# EAGLE design BLE-LORA-Relay-30dbm-v2.1 (EAGLE 8.6.0)
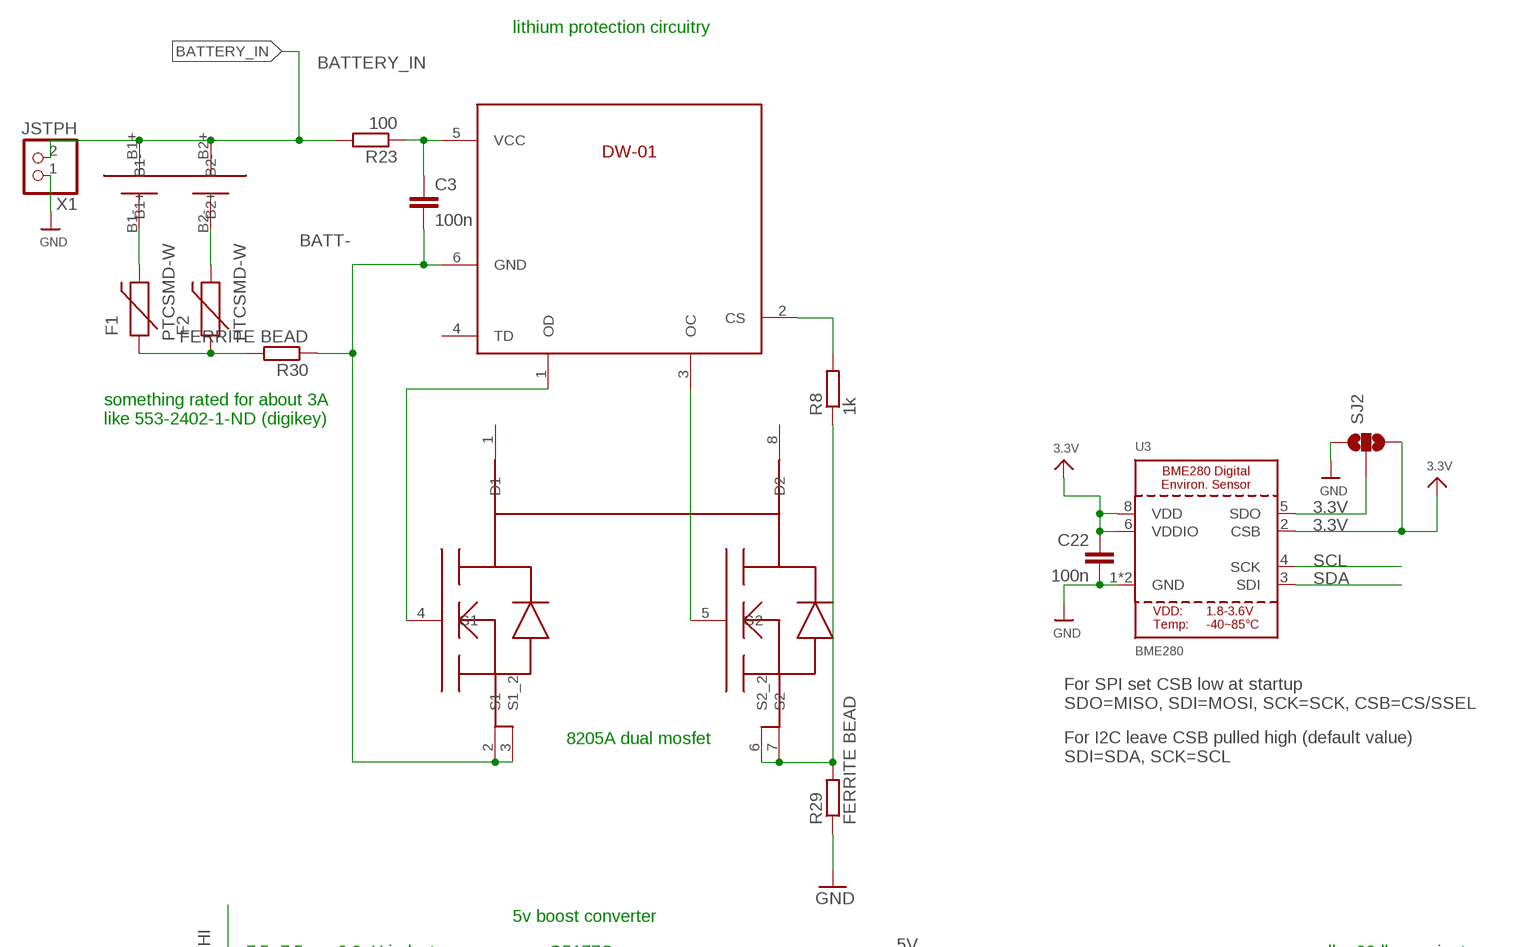
[diagram p0: schematic, sheet 1, part 1 of 3]
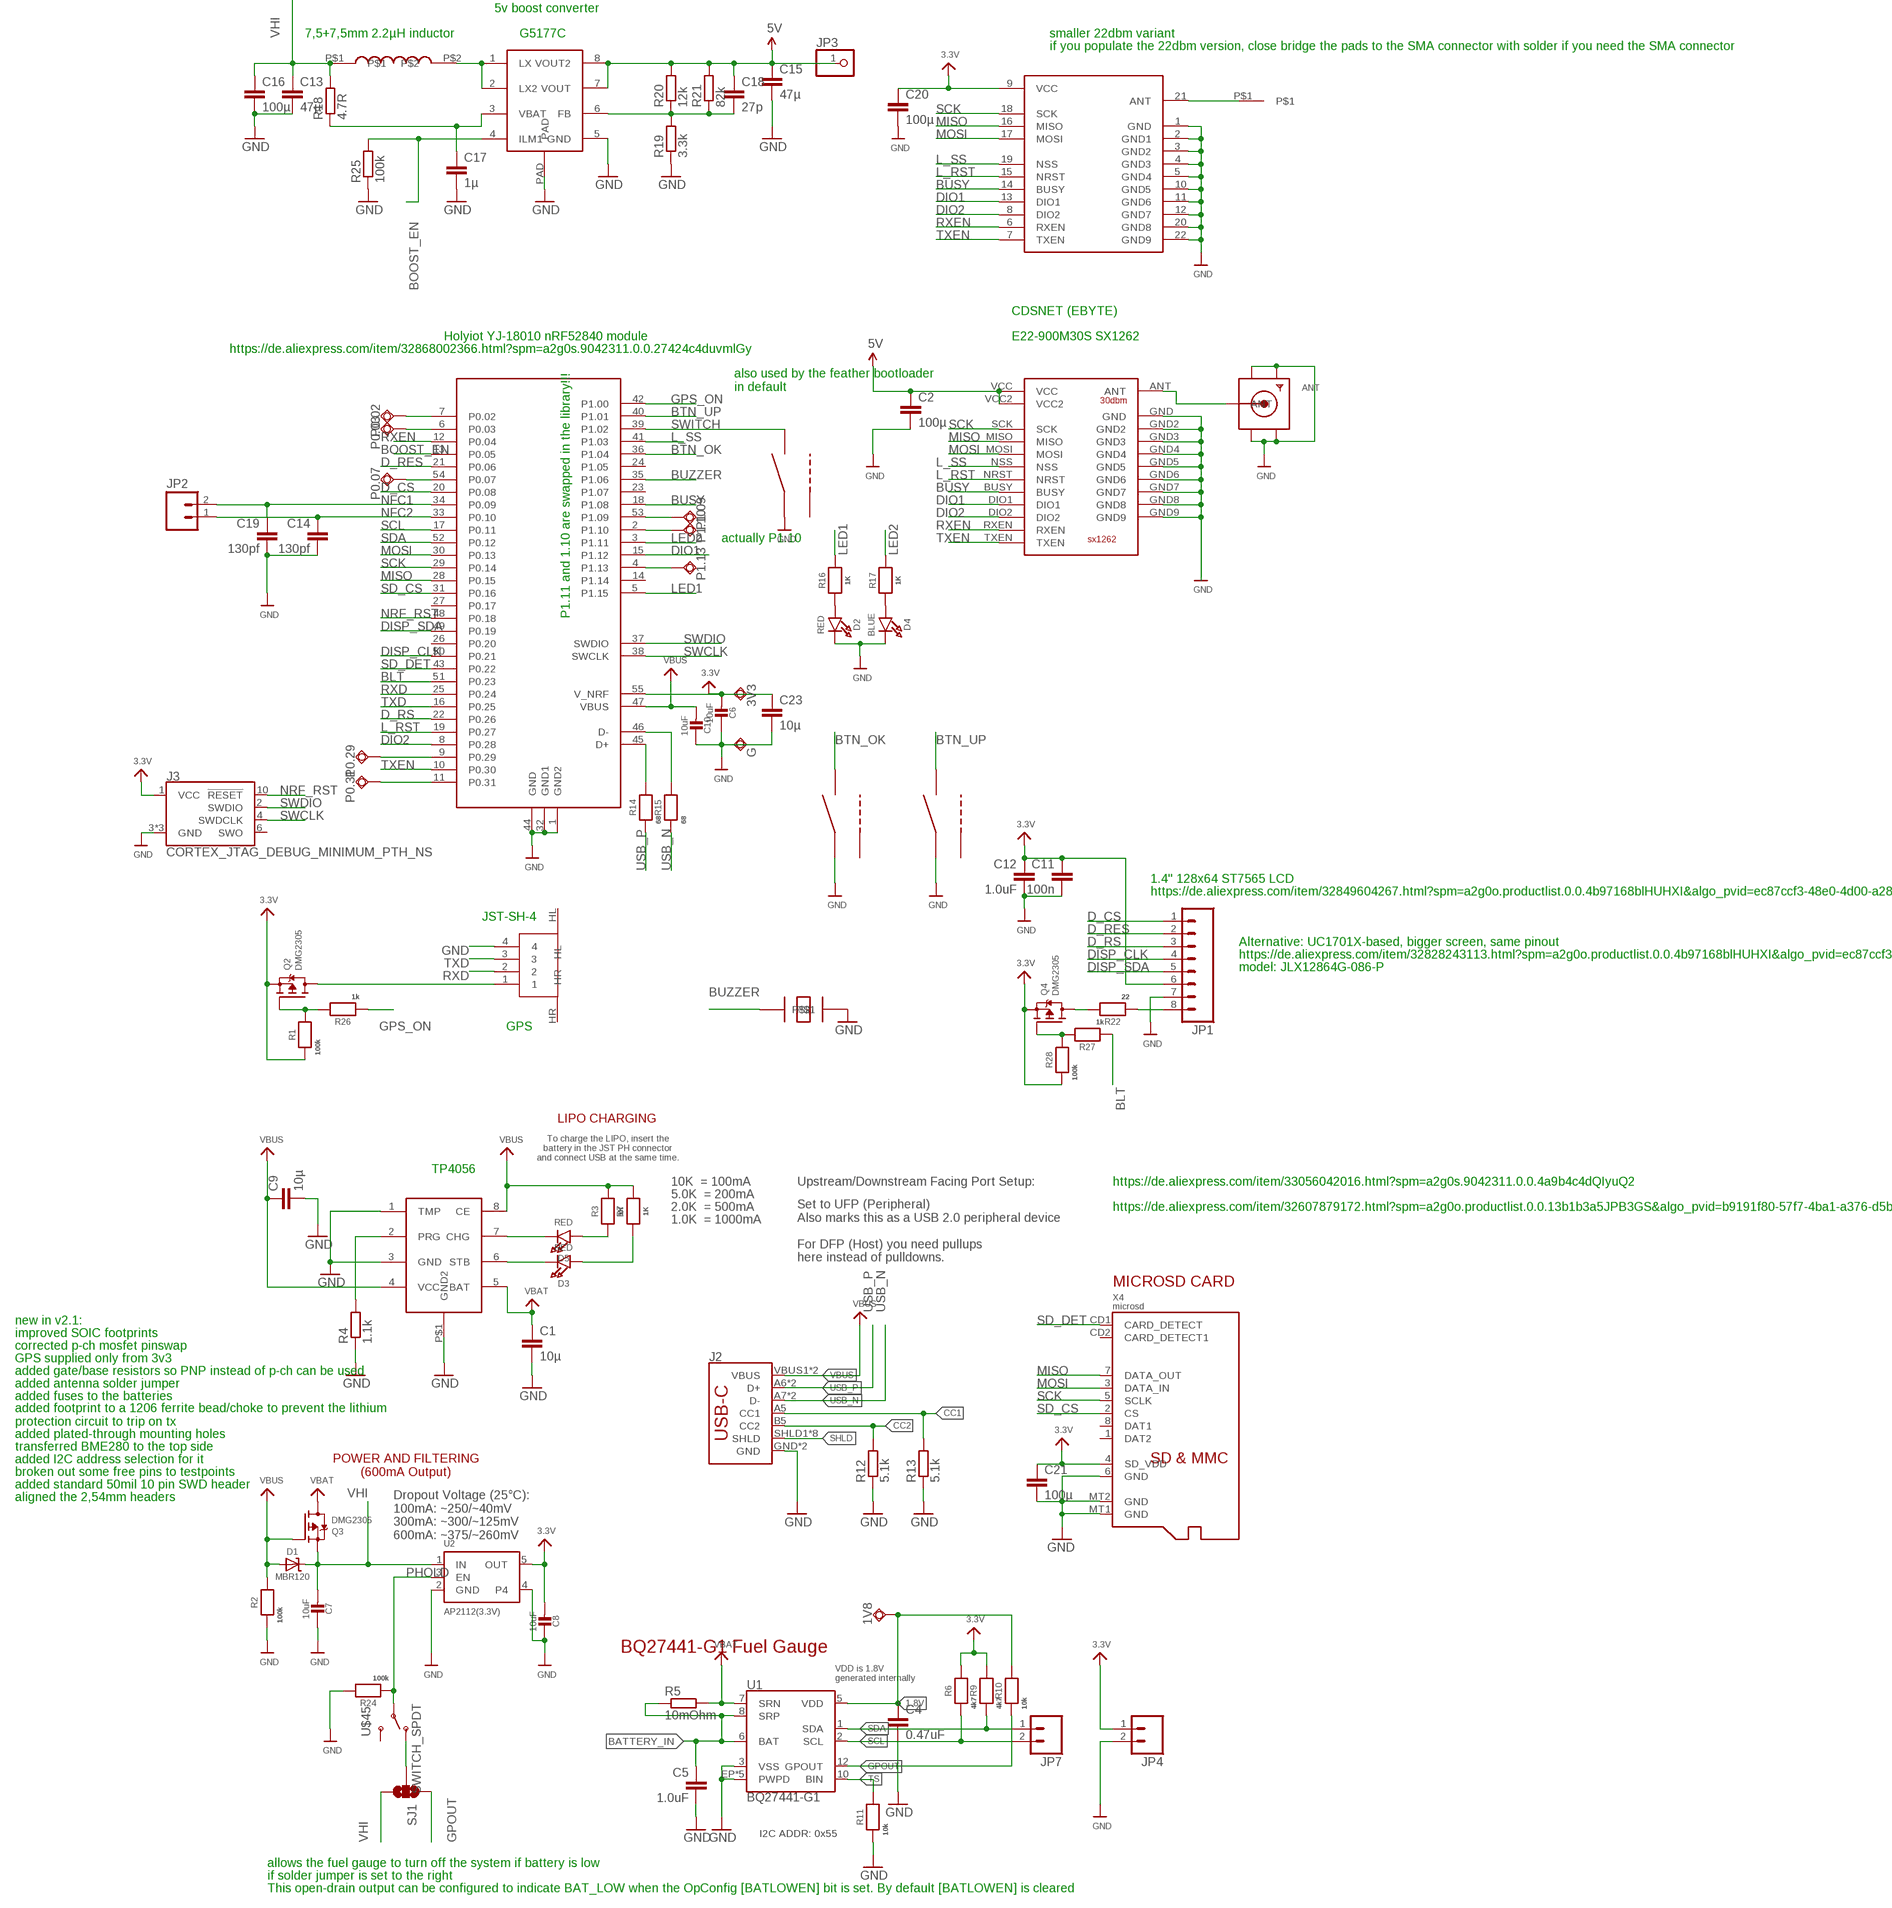
[diagram p1: schematic, sheet 1, part 2 of 3]
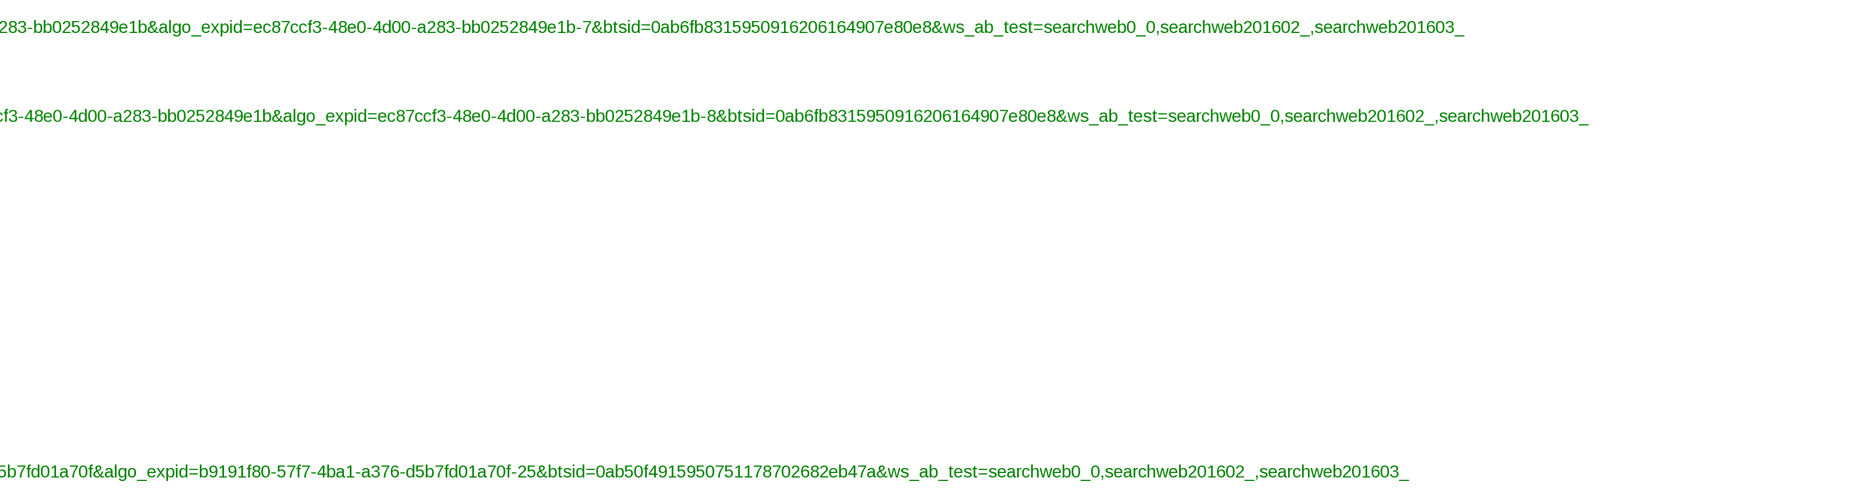
[diagram p2: schematic, sheet 1, part 3 of 3]

## Parts
1V8  TPSQTP13R  [TP13R]
3V3  TPSQTP13R  [TP13R]
ANT  SMACONNECTOR_EDGE  [SMA_EDGELAUNCH]
C1  10µ  C-EUC0805  [C0805]
C2  100µ  C-EUC1206  [C1206]
C3  100n  C-EUC0603  [C0603]
C4  0.47uF  CAP0603-CAP  [0603-CAP]
C5  1.0uF  1.0UF-16V-10%(0603)  [0603-CAP]
C6  10uF  CAP_CERAMIC0805-NOOUTLINE  [0805-NO]
C7  10uF  CAP_CERAMIC0805-NOOUTLINE  [0805-NO]
C8  10uF  CAP_CERAMIC0805-NOOUTLINE  [0805-NO]
C9  10µ  C-EUC0805  [C0805]
C10  10uF  CAP_CERAMIC0805-NOOUTLINE  [0805-NO]
C11  100n  1.0UF-16V-10%(0603)  [0603-CAP]
C12  1.0uF  1.0UF-16V-10%(0603)  [0603-CAP]
C13  47µ  C-EUC0805  [C0805]
C14  130pf  1.0UF-16V-10%(0603)  [0603-CAP]
C15  47µ  C-EUC0805  [C0805]
C16  100µ  C-EUC1206  [C1206]
C17  1µ  C-EUC0603  [C0603]
C18  27p  C-EUC0603  [C0603]
C19  130pf  1.0UF-16V-10%(0603)  [0603-CAP]
C20  100µ  C-EUC1206  [C1206]
C21  100µ  C-EUC1206  [C1206]
C22  100n  1.0UF-16V-10%(0603)  [0603-CAP]
C23  10µ  C-EUC0805  [C0805]
D1  MBR120  DIODE-SCHOTTKYSOD-123  [SOD-123]
D2  RED  LED0805_NOOUTLINE  [CHIPLED_0805_NOOUTLINE]
D3  RED  LED0805_NOOUTLINE  [CHIPLED_0805_NOOUTLINE]
D4  BLUE  LED0805_NOOUTLINE  [CHIPLED_0805_NOOUTLINE]
D5  RED  LED0805_NOOUTLINE  [CHIPLED_0805_NOOUTLINE]
DWN  LS12T2  [LS12T2]
DWN1  LS12T2  [LS12T2]
DWN2  LS12T2  [LS12T2]
F1  PTCSMD-W  [PTC-1206-WIDE]
F2  PTCSMD-W  [PTC-1206-WIDE]
G  TPSQTP13R  [TP13R]
J2  USB_C16PIN  [USB-C-16P]
J3  CORTEX_JTAG_DEBUG_MINIMUM_PTH_NS  [2X5-PTH-1.27MM-NO_SILK]
JP1  M08  [1X08_ROUND]
JP2  M02PTH  [1X02]
JP3  PINHD-1X1  [1X01]
JP4  M02PTH  [1X02]
JP7  M02PTH  [1X02]
P0.02  TPSQTP13R  [TP13R]
P0.03  TPSQTP13R  [TP13R]
P0.07  TPSQTP13R  [TP13R]
P0.29  TPSQTP13R  [TP13R]
P0.31  TPSQTP13R  [TP13R]
P1.09  TPSQTP13R  [TP13R]
P1.10  TPSQTP13R  [TP13R]
P1.13  TPSQTP13R  [TP13R]
Q2  DMG2305  MOSFET-P  [SOT23-R]
Q3  DMG2305  MOSFET-P  [SOT23-R]
Q4  DMG2305  MOSFET-P  [SOT23-R]
R1  100k  RESISTOR_0603_NOOUT  [0603-NO]
R2  100k  RESISTOR_0603_NOOUT  [0603-NO]
R3  1K  RESISTOR_0603_NOOUT  [0603-NO]
R4  1.1k  R-EU_R0603  [R0603]
R5  10mOhm  R-EU_R0805  [R0805]
R6  4k7  RESISTOR_0603_NOOUT  [0603-NO]
R7  1K  RESISTOR_0603_NOOUT  [0603-NO]
R8  1k  R-EU_R0603  [R0603]
R9  4k7  RESISTOR_0603_NOOUT  [0603-NO]
R10  10k  RESISTOR_0603_NOOUT  [0603-NO]
R11  10k  RESISTOR_0603_NOOUT  [0603-NO]
R12  5.1k  R-EU_R0603  [R0603]
R13  5.1k  R-EU_R0603  [R0603]
R14  68  RESISTOR_0603_NOOUT  [0603-NO]
R15  68  RESISTOR_0603_NOOUT  [0603-NO]
R16  1K  RESISTOR_0603_NOOUT  [0603-NO]
R17  1K  RESISTOR_0603_NOOUT  [0603-NO]
R18  4.7R  R-EU_R0603  [R0603]
R19  3.3k  R-EU_R0603  [R0603]
R20  12k  R-EU_R0603  [R0603]
R21  82k  R-EU_R0603  [R0603]
R22  22  RESISTOR_0603_NOOUT  [0603-NO]
R23  100  R-EU_R0603  [R0603]
R24  100k  RESISTOR_0603_NOOUT  [0603-NO]
R25  100k  R-EU_R0603  [R0603]
R26  1k  RESISTOR_0603_NOOUT  [0603-NO]
R27  1k  RESISTOR_0603_NOOUT  [0603-NO]
R28  100k  RESISTOR_0603_NOOUT  [0603-NO]
R29  FERRITE BEAD  R-EU_R1206  [R1206]
R30  FERRITE BEAD  R-EU_R1206  [R1206]
SJ1  SOLDERJUMPER_2WAY-OLDS  [SJ_3]
SJ2  SOLDERJUMPER_2WAY-OLDS  [SJ_3]
U1  BQ27441-G1  [PDSO-N12]
U2  AP2112(3.3V)  VREG_SOT23-5  [SOT23-5]
U3  BME280  [BME280]
U$2  BUZZER  [BUZZER]
U$10  2X18650  [2X18650]
U$14  NRF52840  [NRF52840MOD]
U$15  SX1262-30DBM  [SX1262-30DBM]
U$17  JST-SH-3  [JST-SH-3]
U$35  7.5MM-COIL  [7.5MM_COIL]
U$36  SX1292-EBYTE  [SX1262_EBYTE]
U$38  DW-01  [SOT23-6]
U$39  G5177C_G5177C  [G5177C_SO-08]
U$41  SOLDERPAD  [SOLDERPAD]
U$45  SWITCH_SPDT  [KPS-1290]
U$46  8205A  [TSSOP8]
U$47  TP4056BETTER_TP4056  [TP4056BETTER_SO-08]
X1  JSTPH  CON_JST_PH_2PIN  [JSTPH2]
X4  microsd  MICROSD  [MICROSD]

## Nets
1.8V: 1V8.TP C4.1 R10.2 U1.5(VDD)
3.3V [power]: 3V3.TP C6.2 C8.2 C11.1 C12.1 C20.1 C21.1 C22.1 C23.1 J3.1(VCC) JP1.6 JP4.1 Q2.2(S) Q4.2(S) R1.1 R6.2 R9.2 R28.1 SJ2.3 U2.5(OUT) U3.2(CSB) U3.6(VDDIO) U3.8(VDD) U$14.55(V_NRF) U$36.9(VCC) X4.4(SD_VDD)
5V: C2.1 C15.1 C18.1 JP3.1 R20.2 R21.2 U$15.VCC U$15.VCC2 U$39.7(VOUT) U$39.8(VOUT2)
ANT: ANT.P(ANT) U$15.ANT
BATT-: C3.2 R30.1 U$38.6(GND) U$46.2(S1) U$46.3(S1_2)
BATTERY_IN: C5.1 R5.1 R23.2 U1.6(BAT) U1.8(SRP) U$10.B1+ U$10.B2+ X1.2
BLT: R27.1 U$14.51(P0.23)
BOOST_EN: R25.2 U$14.13(P0.05) U$39.4(ILM1)
BTN_OK [power]: DWN.1 U$14.36(P1.04)
BTN_UP: DWN1.1 U$14.40(P1.01)
BUSY: U$14.18(P1.08) U$15.BUSY U$36.14(BUSY)
BUZZER: U$2.P$1 U$14.35(P1.06)
CC1: J2.A5(CC1) R13.2
CC2: J2.B5(CC2) R12.2
D_CS: JP1.1 U$14.20(P0.08)
D_RES: JP1.2 U$14.21(P0.06)
D_RS: JP1.3 U$14.22(P0.26)
DIO1: U$14.15(P1.12) U$15.DIO1 U$36.13(DIO1)
DIO2: U$14.8(P0.28) U$15.DIO2 U$36.8(DIO2)
DISP_CLK: JP1.4 U$14.50(P0.21)
DISP_SDA: JP1.5 U$14.49(P0.19)
FB: C18.2 R19.2 R20.1 R21.1 U$39.6(FB)
GGGG: Q4.1(G) R27.2 R28.2
GND: ANT.GND@1(GND4) ANT.GND@2(GND3) ANT.GND@3(GND2) ANT.GND@4(GND1) C1.2 C2.2 C4.2 C5.2 C6.1 C7.1 C8.1 C9.2 C10.1 C11.2 C12.2 C13.2 C14.2 C15.2 C16.2 C17.2 C19.2 C20.2 C21.2 C22.2 C23.2 D2.C D4.C DWN1.2 DWN2.2 DWN.2 G.TP J2.GND J2.GND2(GND) J3.3(GND) J3.5(GND) J3.9(GND) JP1.7 JP4.2 R2.1 R4.1 R11.1 R12.1 R13.1 R19.1 R24.2 R25.1 R29.1 SJ2.1 U1.3(VSS) U1.EP1(PWPD) U1.EP2(PWPD) U1.EP3(PWPD) U1.EP4(PWPD) U1.EP(PWPD) U2.2(GND) U2.4 U3.1(GND) U3.7(GND) U$2.P$2 U$14.1(GND2) U$14.32(GND1) U$14.44(GND) U$15.GND U$15.GND2 U$15.GND3 U$15.GND4 U$15.GND5 U$15.GND6 U$15.GND7 U$15.GND8 U$15.GND9 U$17.4 U$36.1(GND) U$36.2(GND1) U$36.3(GND2) U$36.4(GND3) U$36.5(GND4) U$36.10(GND5) U$36.11(GND6) U$36.12(GND7) U$36.20(GND8) U$36.22(GND9) U$39.5(GND) U$39.PAD U$47.1(TMP) U$47.3(GND) U$47.P$1(GND2) X1.1 X4.6(GND) X4.MT1(GND) X4.MT2(GND)
GPOUT: R10.1 SJ1.1 U1.12(GPOUT)
GPS_ON: R26.1 U$14.42(P1.00)
L_RST: U$14.19(P0.27) U$15.NRST U$36.15(NRST)
L_SS: U$14.41(P1.03) U$15.NSS U$36.19(NSS)
LED1: R16.2 U$14.5(P1.15)
LED2: R17.2 U$14.3(P1.11)
MISO: U$14.28(P0.15) U$15.MISO U$36.16(MISO) X4.7(DATA_OUT)
MOSI: U$14.30(P0.13) U$15.MOSI U$36.17(MOSI) X4.3(DATA_IN)
N$1: D5.A R3.1
N$2: Q4.3(D) R22.2
N$3: SJ1.2 U$45.O
N$4: JP1.8 R22.1
N$5: Q2.1(G) R1.2 R26.2
N$6: R14.2 U$14.45(D+)
N$7: R15.2 U$14.46(D-)
N$8: D3.A R7.1
N$9: U$38.1(OD) U$46.4(G1)
N$10: R4.2 U$47.2(PRG)
N$11: D3.C U$47.6(STB)
N$12: D5.C U$47.7(CHG)
N$13: D2.A R16.1
N$14: D4.A R17.1
N$15: Q2.3(D) U$17.1
N$16: C17.1 R18.1 U$39.3(VBAT)
N$17: U$35.P$2 U$39.1(LX) U$39.2(LX2)
N$18: U$38.3(OC) U$46.5(G2)
N$19: C3.1 R23.1 U$38.5(VCC)
N$20: U$36.21(ANT) U$41.P$1
N$21: F1.2 U$10.B1-
N$22: F2.2 U$10.B2-
N$23: R8.2 U$38.2(CS)
N$24: R8.1 R29.2 U$46.6(S2_2) U$46.7(S2)
N$25: SJ2.2 U3.5(SDO)
N$26: P0.02.TP U$14.7(P0.02)
N$27: P0.03.TP U$14.6(P0.03)
N$28: P1.10.TP U$14.2(P1.10)
N$29: P1.13.TP U$14.4(P1.13)
N$30: P0.31.TP U$14.11(P0.31)
N$31: P0.29.TP U$14.9(P0.29)
N$32: P1.09.TP U$14.53(P1.09)
N$33: P0.07.TP U$14.54(P0.07)
N$34: F1.1 F2.1 R30.2
NFC1: C19.1 JP2.2 U$14.34(P0.09)
NFC2: C14.1 JP2.1 U$14.33(P0.10)
NRF_RST: J3.10(!RESET) U$14.48(P0.18)
PHOLD: R24.1 U2.3(EN) U$45.P
RXD: U$14.25(P0.24) U$17.2
RXEN: U$14.12(P0.04) U$15.RXEN U$36.6(RXEN)
SCK: U$14.29(P0.14) U$15.SCK U$36.18(SCK) X4.5(SCLK)
SCL: JP7.2 R6.1 U1.2(SCL) U3.4(SCK) U$14.17(P0.11)
SD_CS: U$14.31(P0.16) X4.2(CS)
SD_DET: U$14.43(P0.22) X4.CD1(CARD_DETECT)
SDA: JP7.1 R9.1 U1.1(SDA) U3.3(SDI) U$14.52(P0.12)
SHLD: J2.SHLD1(SHLD) J2.SHLD2(SHLD) J2.SHLD3(SHLD) J2.SHLD4(SHLD) J2.SHLD5(SHLD) J2.SHLD6(SHLD) J2.SHLD7(SHLD) J2.SHLD8(SHLD)
SWCLK: J3.4(SWDCLK) U$14.38(SWCLK)
SWDIO: J3.2(SWDIO) U$14.37(SWDIO)
SWITCH: DWN2.1 U$14.39(P1.02)
TS: R11.2 U1.10(BIN)
TXD: U$14.16(P0.25) U$17.3
TXEN: U$14.10(P0.30) U$15.TXEN U$36.7(TXEN)
USB_N: J2.A7(D-) J2.B7(D-) R15.1
USB_P: J2.A6(D+) J2.B6(D+) R14.1
VBAT [power]: C1.1 Q3.3(D) R5.2 U1.7(SRN) U$47.5(BAT)
VBUS [power]: C9.1 C10.2 D1.A J2.VBUS1(VBUS) J2.VBUS2(VBUS) Q3.1(G) R2.2 R3.2 R7.2 U$14.47(VBUS) U$47.4(VCC) U$47.8(CE)
VHI [power]: C7.2 C13.1 C16.1 D1.C Q3.2(S) R18.2 SJ1.3 U2.1(IN) U$35.P$1
Unconnected: DWN1.FRAME(FRM) DWN2.FRAME(FRM) DWN.FRAME(FRM) J3.6(SWO) U$14.14(P1.14) U$14.23(P1.07) U$14.24(P1.05) U$14.26(P0.20) U$14.27(P0.17) U$17.HL U$17.HR U$38.4(TD) U$45.S U$46.1(D1) U$46.8(D2) X4.1(DAT2) X4.8(DAT1) X4.CD2(CARD_DETECT1)

## Notes on the sheet
- lithium protection circuitry
- something rated for about 3A
  like 553-2402-1-ND (digikey)
- For SPI set CSB low at startup
  SDO=MISO, SDI=MOSI, SCK=SCK, CSB=CS/SSEL
- 8205A dual mosfet
- For I2C leave CSB pulled high (default value)
  SDI=SDA, SCK=SCL
- 5v boost converter
- 7,5+7,5mm 2.2µH inductor | G5177C | smaller 22dbm variant
- if you populate the 22dbm version, close bridge the pads to the SMA connector with solder if you need the SMA connector
- CDSNET (EBYTE)
- Holyiot YJ-18010 nRF52840 module | E22-900M30S SX1262
- https://de.aliexpress.com/item/32868002366.html?spm=a2g0s.9042311.0.0.27424c4duvmlGy
- also used by the feather bootloader 
  in default
- actually P1.10
- P1.11 and 1.10 are swapped in the library!!!
- 1.4'' 128x64 ST7565 LCD
- https://de.aliexpress.com/item/32849604267.html?spm=a2g0o.productlist.0.0.4b97168blHUHXI&algo_pvid=ec87ccf3-48e0-4d00-a283-bb0252849e1b&algo_expid=ec87ccf3-48e0-4d00-a283-bb0252849e1b-7&btsid=0ab6fb8315950916206164907e80e8&ws_ab_test=searchweb0_0,searchweb201602_,searchweb201603_
- JST-SH-4
- Alternative: UC1701X-based, bigger screen, same pinout
- https://de.aliexpress.com/item/32828243113.html?spm=a2g0o.productlist.0.0.4b97168blHUHXI&algo_pvid=ec87ccf3-48e0-4d00-a283-bb0252849e1b&algo_expid=ec87ccf3-48e0-4d00-a283-bb0252849e1b-8&btsid=0ab6fb8315950916206164907e80e8&ws_ab_test=searchweb0_0,searchweb201602_,searchweb201603_
- model: JLX12864G-086-P
- GPS
- LIPO CHARGING
- To charge the LIPO, insert the
  battery in the JST PH connector
  and connect USB at the same time.
- TP4056
- 10K  = 100mA | Upstream/Downstream Facing Port Setup: | https://de.aliexpress.com/item/33056042016.html?spm=a2g0s.9042311.0.0.4a9b4c4dQIyuQ2
- 5.0K  = 200mA
- 2.0K  = 500mA | https://de.aliexpress.com/item/32607879172.html?spm=a2g0o.productlist.0.0.13b1b3a5JPB3GS&algo_pvid=b9191f80-57f7-4ba1-a376-d5b7fd01a70f&algo_expid=b9191f80-57f7-4ba1-a376-d5b7fd01a70f-25&btsid=0ab50f4915950751178702682eb47a&ws_ab_test=searchweb0_0,searchweb201602_,searchweb201603_
- 1.0K  = 1000mA
- Set to UFP (Peripheral)
  Also marks this as a USB 2.0 peripheral device
  
  For DFP (Host) you need pullups
  here instead of pulldowns.
- MICROSD CARD
- new in v2.1:
- improved SOIC footprints
- corrected p-ch mosfet pinswap
- GPS supplied only from 3v3
- added gate/base resistors so PNP instead of p-ch can be used
- added antenna solder jumper
- added fuses to the batteries
- added footprint to a 1206 ferrite bead/choke to prevent the lithium  
  protection circuit to trip on tx
- added plated-through mounting holes
- transferred BME280 to the top side
- added I2C address selection for it
- broken out some free pins to testpoints
- POWER AND FILTERING
  (600mA Output)
- added standard 50mil 10 pin SWD header
- aligned the 2,54mm headers
- Dropout Voltage (25°C):
  100mA: ~250/~40mV
  300mA: ~300/~125mV
  600mA: ~375/~260mV
- BQ27441-G1 Fuel Gauge
- VDD is 1.8V
  generated internally
- I2C ADDR: 0x55
- allows the fuel gauge to turn off the system if battery is low
- if solder jumper is set to the right
- This open-drain output can be configured to indicate BAT_LOW when the OpConfig [BATLOWEN] bit is set. By default [BATLOWEN] is cleared

## Library data of the parts
1V8 3V3 G P0.02 P0.03 P0.07 P0.29 P0.31 P1.09 P1.10 P1.13 = testpad:TPSQ: Test pad
ANT = adafruit:SMACONNECTOR: SMA Connector 90° DIP SMA Connector, 50 Ohm (4UConnector: 07259)
C1-C3 C9 C13 C15-C18 C20 C21 C23 = rcl:C-EU: CAPACITOR, European symbol; SPICEPREFIX: C
C4 = SparkFun-Capacitors:CAP: Capacitor Standard 0603 ceramic capacitor, and 0.1" leaded capacitor.; PROD_ID: CAP-13216
C5 C12 = SparkFun-Capacitors:1.0UF-16V-10%(0603): CAP-00868; PROD_ID: CAP-00868
C6-C8 C10 = microbuilder:CAP_CERAMIC: Ceramic Capacitors For new designs, use the packages preceded by an '_' character since they are more reliable: The following footprints should be used on most boards: _0402 - Standard footprint for regular board layouts _0603 - Standard footprint for regular board layouts _0805 - Standard footprint for regular board layouts _1206 - Standard footprint for regular board layouts For extremely tight-pitch boards where space is at a premium, the following 'micro-pitch' footprints can be used (smaller pads, no silkscreen outline, etc.): _0402MP - Micro-pitch footprint for very dense/compact boards _0603MP - Micro-pitch footprint for very dense/compact boards _0805MP - Micro-pitch footprint for very dense/compact boards _1206MP - Micro-pitch footprint for very dense/compact boards
C11 C14 C19 C22 = SparkFun-Capacitors:1.0UF-16V-10%(0603): CAP-00868; PROD_ID: CAP-00868; VALUE: 1.0uF
D1 = microbuilder:DIODE-SCHOTTKY
D2-D5 = microbuilder:LED: LED 0603 - 0603 Surface Mount Package 2mA: Green LED - Low Power (3.9mcd, 2ma, 1.7Vf) - Digikey: 475-2709-2-ND Orange LED - Low Power (9.8mcd, 2ma, 1.8Vf) - Digikey: 475-1194-2-ND Red LED - Low Power (5mcd, 2ma, 1.8Vf) - Digikey: 475-1195-2-ND Yellow LED - Low Power (7mcd, 2ma, 1.8Vf) - Digikey: 475-1196-2-ND 5mA: Blue LED - Low Power (17mcd, 5ma, 2.9Vf) - Digikey: LNJ937W8CRACT-ND 0805 - 0805 Surface Mount Package 2mA: Red LED (8.8mcd, 2mA, 1.8Vf, Clear) - Low Power [Digikey: 475-2510-1-ND] Green LED (5mcd, 2mA, 1.8Vf, Clear) - Low Power [Digikey: 475-2730-1-ND] Yellow LED (11.3mcd, 2mA, 1.8Vf, Clear) - Low Power [Digikey: 475-2555-1-ND] 20mA: Red LED (104mcd, 20mA, Diffused) - LS R976 [Digikey: 475-1278-6-ND] Red LED (12mcd, 20mA, 2.0Vf, Clear) - APT2012EC [Digikey: 754-1128-1-ND] Green LED (15mcd, 20mA, 2.2Vf, Clear) - APT2012GC [Digikey: 754-1131-1-ND] Orange LED (160mcd, 20mA, 2.1Vf, Clear) - APT2012SECK [Digikey: 754-1130-1-ND] 1206 - 1206 Surface Mount Package Green LED (26mcd, 20mA, Diffused) - LG N971 [Digikey: 475-1407-6-ND] Red LED (15mcd, 20mA, Diffused) - LH N974 [Digikey: 475-1416-6-ND] Cree - Cree High-Power Surface Mount LEDs XPEBWT-L1-0000-00D50 - White 111lm 350mA 2.9Vf 6200K 110° XTEAWT-00-0000-00000LEE3 - White 114lm 350mA 2.85Vf 5000K 115° Everlight - Everlight 45-21 Series Surface Mount LEDs 45-21/QK2C-B2832AC2CB2/2T - Warm White 2000mcd 20mA 3.25Vf 3050K 120° 45-21/LK2C-B38452C4CB2/2T - Nuetral White 2000mcd 20mA 3.25Vf 4150K 120° 45-21/LK2C-B50634C6CB2/2T - Cold White 2200mcd 20mA 3.25Vf 5650K 120° PLCC2 Reverse Mount LS T77K-J1L2-1-0-2-R18-Z - Red 11.25mcd 2mA 1.8Vf 630nm 120° LO T77K-L1M2-24-Z - Orange 19.6mcd 2mA 1.8Vf 606nm 120° LY T77K-K2M1-26-Z - Yellow 15.7mcd 2mA 1.8Vf 587nm 120°
DWN DWN1 DWN2 = LS12T2:LS12T2
F1 F2 = SparkFun-PowerIC:PTC: Resettable Fuse PTC Resettable Fuse. Spark Fun Electronics SKU : COM-08357
J2 = SparkFun-Connectors:USB_C: USB Type C 16Pin Connector Super Speed pins not available on the 16-pin purely SMD connector so this part is best for USB 2.0 implementations. D1 and D2 are tied together enabling D+/- no matter which way the cable is plugged into the connector. The two channel configuration pins (CC1/2) are exposed. These are normally connected to ground via 5.1k resistors but can be reconfigured for high current/high power applications.; PROD_ID: CONN-14122
J3 = SparkFun-Connectors:CORTEX_JTAG_DEBUG_MINIMUM: Cortex Debug Connector - 10 pin Supports JTAG debug, Serial Wire debug, and Serial Wire Viewer. PTH and SMD connector options available. General Connector Information <http://infocenter.arm.com/help/topic/com.arm.doc.faqs/attached/13634/cortex_debug_connectors.pdf> Products: PTH Connector <http://www.digikey.com/product-detail/en/cnc-tech/3220-10-0100-00/1175-1627-ND/3883661> -via Digi-Key SparkFun PSoc <https://www.sparkfun.com/products/13229> SparkFun T <https://www.sparkfun.com/products/13810>
JP1 = SparkFun-Connectors:M08: Header 8 Standard 8-pin 0.1" header. Use with straight break away headers (SKU : PRT-00116), right angle break away headers (PRT-00553), swiss pins (PRT-00743), machine pins (PRT-00117), and female headers (PRT-00115).
JP2 JP4 JP7 = SparkFun-Connectors:M02: Standard 2-pin 0.1" header. Use with - straight break away headers ( PRT-00116) - right angle break away headers (PRT-00553) - swiss pins (PRT-00743) - machine pins (PRT-00117) - female headers (PRT-00115) Molex polarized connector foot print use with: PRT-08233 with associated crimp pins and housings. 2.54_SCREWTERM for use with PRT-10571. 3.5mm Screw Terminal footprints for PRT-08084 5mm Screw Terminal footprints for use with PRT-08432
JP3 = adafruit:PINHD-1X1: Pin header 1x1 for 0.1" spacing With round pins
Q2-Q4 = microbuilder:MOSFET-P: P-Channel Mosfet LEGEND VDS: Voltage Drain-Source ID: Drain Current RDS(ON): Drain-Source On-State Resistance VGS(TH): Gate-Source Threshold Voltage CISS: Drain-Source Input Capacitance SOT-23 Name VDS ID RDS(ON) VGS(TH) CISS Order Number IRLML5103 30V 760mA 600 mOhm -- 75pF @ 25V Digikey: IRLML5103PBFCT-ND IRLML6401 12V 4.3A 50 mOhm 950mV @ 250µA 830pF @ 10V Digikey: IRLML6401PBFTR-ND NTR0202PL 20V 400mA 800 mOhm 2.3V @ 250uA 70pF @ 5V Digikey: NTR0202PLT1GOSTR-ND NTR4101PT1G 20V 1.8A 85 mOhm 1.2V @ 250uA 675pF @ 10V Digikey: NTR4101PT1GOSCT-ND DMP2004K 20V 600mA 900 mOhm 1V @ 250uA 175pF @ 16V Digikey: DMP2004KDICT-ND PMV65XP 20V 3.9A 76 mOhm 950mV @ 1mA 725pF @ 20V Digikey: 568-2358-2-ND TO-252 Name VDS ID RDS(ON) VGS(TH) CISS Order Number AOD417 30V 25A 34 mOhm 3V @ 250µA 920pF @ 15V Digikey: 785-1106-2-ND PowerPak Name VDS ID RDS(ON) VGS(TH) CISS Order Number AON7401 30V 12A 14 mOhm 3V @ 250µA 2600pF @ 15V Digikey: 785-1302-1-ND
R1-R3 R6 R7 R9-R11 R14-R17 R22 R24 R26-R28 = microbuilder:RESISTOR: Resistors For new designs, use the packages preceded by an '_' character since they are more reliable: The following footprints should be used on most boards: _0402 - Standard footprint for regular board layouts _0603 - Standard footprint for regular board layouts _0805 - Standard footprint for regular board layouts _1206 - Standard footprint for regular board layouts For extremely tight-pitch boards where space is at a premium, the following 'micro-pitch' footprints can be used (smaller pads, no silkscreen outline, etc.): _0402MP - Micro-pitch footprint for very dense/compact boards _0603MP - Micro-pitch footprint for very dense/compact boards _0805MP - Micro-pitch footprint for very dense/compact boards _1206MP - Micro-pitch footprint for very dense/compact boards
R4 R5 R8 R12 R13 R18-R21 R23 R25 = rcl:R-EU_: RESISTOR, European symbol; SPICEPREFIX: R
R29 R30 = rcl:R-EU_: RESISTOR, European symbol
SJ1 SJ2 = SparkFun-Retired:SOLDERJUMPER_2WAY-OLD: Solder Jumper 2 way solder jumper
U1 = battery-management-temp:BQ27441-G1; PROD_ID: IC-13220
U2 = microbuilder:VREG_SOT23-5: SOT23-5 Fixed Voltage Regulators Part Current Out V Out V In V Dropout θJA (°C/W) TJ (°C) Digikey Part No. ADP121 150mA 3.3V 3.4-5.5V 0.09V @ 150mA -- -- ADP121-AUJZ33R7CT-ND ADP121 150mA 3.0V 3.1-5.5V 0.09V @ 150mA -- -- ADP121-AUJZ30R7CT-ND ADP122 300mA 3.3V 3.4-5.5V 0.085V @ 300mA -- -- ADP122AUJZ-3.3-R7CT-ND ADP1712 300mA 3.3V 3.5-5.5V 0.17V @ 300mA -- -- ADP1712AUJZ-3.3-R7TR-ND AP7311 (Low Cost) 150mA 3.3V 3.5-6V 0.15V @ 150mA -- -- AP7311-33WG-7DICT-ND LD39015M18R 150mA 1.8V 1.9V-5.5V 0.08V @ 100mA -- -- 497-6977-1-ND LP2985A-33DBVR 150mA 3.3V 3.3-16V 0.28V @ 150mA 206 150 296-18479-1-ND MCP1824T-3302E/OT 300mA 3.3V 3.5V-6V 0.2V @ 300mA -- -- MCP1824T-3302E/OTCT-ND MIC5205-2.5YM5 TR 150mA 2.5V 2.7-16V 0.165V @ 150mA -- -- 576-1257-2-ND MIC5205-3.0YM5 TR 150mA 3.0V 3.2V-16V 0.165V @ 150mA -- -- 576-1258-2-ND MIC5205-3.3YM5 TR 150mA 3.3V 3.5V-16V 0.165V @ 150mA -- -- 576-1259-2-ND TPS780330220 150mA 3.3V+2.2V 3.6-5.5V 250mV Max -- -- 296-23332-1-ND TDA3663/N1,135 100mA 3.3V 3.5-45V 0.18V @ 50mA -- -- 568-5343-1-ND Max operating temp can be calculated using θJA, TJ (max junction temperature), and power in watts. Set the "Maximum Ambient Temperature" until it reaches TJ ("Max Junction Temperature"), which is the absolute limit for safe use of the regulator: Heat Sink Temperature Calculator <http://www.daycounter.com/Calculators/Heat-Sink-Temperature-Calculator.phtml> For example, With 12V source into a 3.3V LP2985 and a 30mA load, we are dissipating (12V-3.3V) * 0.03A = 0.261W. With a θJA of 206 °C/W, a TJ of 150°C, and 261mW we can safely use the chip without a heat sink up to 75°C (=147.1°C Junction Temperature).
U3 = microbuilder:BME280: BME280 - Environmental Sensor (I2C + SPI)
U$2 = buzzer:BUZZER
U$10 = 2x18650:2X18650
U$14 = nrf52840mod:NRF52840
U$15 = SX1262-30dbm:SX1262-30DBM
U$17 = JST-SH-4:JST-SH-3
U$35 = 7.5mm-COIL:7.5MM-COIL
U$36 = sx1262-EBYTE:SX1292-EBYTE
U$38 = DW-01:DW-01
U$39 = TP4056andGC5177:G5177C_G5177C
U$41 = solderpad:SOLDERPAD
U$45 = SparkFun-Retired:SWITCH_SPDT: SWCH-10651 Side-actuated SPDT slide switch, as used on the Arduino Pro; PROD_ID: SWCH-10651
U$46 = 8205A:8205A
U$47 = TP4056andGC5177:TP4056BETTER_TP4056
X1 = microbuilder:CON_JST_PH_2PIN: JST 2-Pin Right-Angle Connector PH-Series - 4UConnector: 17311 SH-Series - 4UConnector: 07278
X4 = microbuilder:MICROSD: MicroSD/Transflash Card Holder with SPI pinout 3M: 2908-05WB-MG 4UConnector: 19656 Footprint courtesy: Adafruit Industries

## Net classes
1 power: width 0.178 mm

## Board
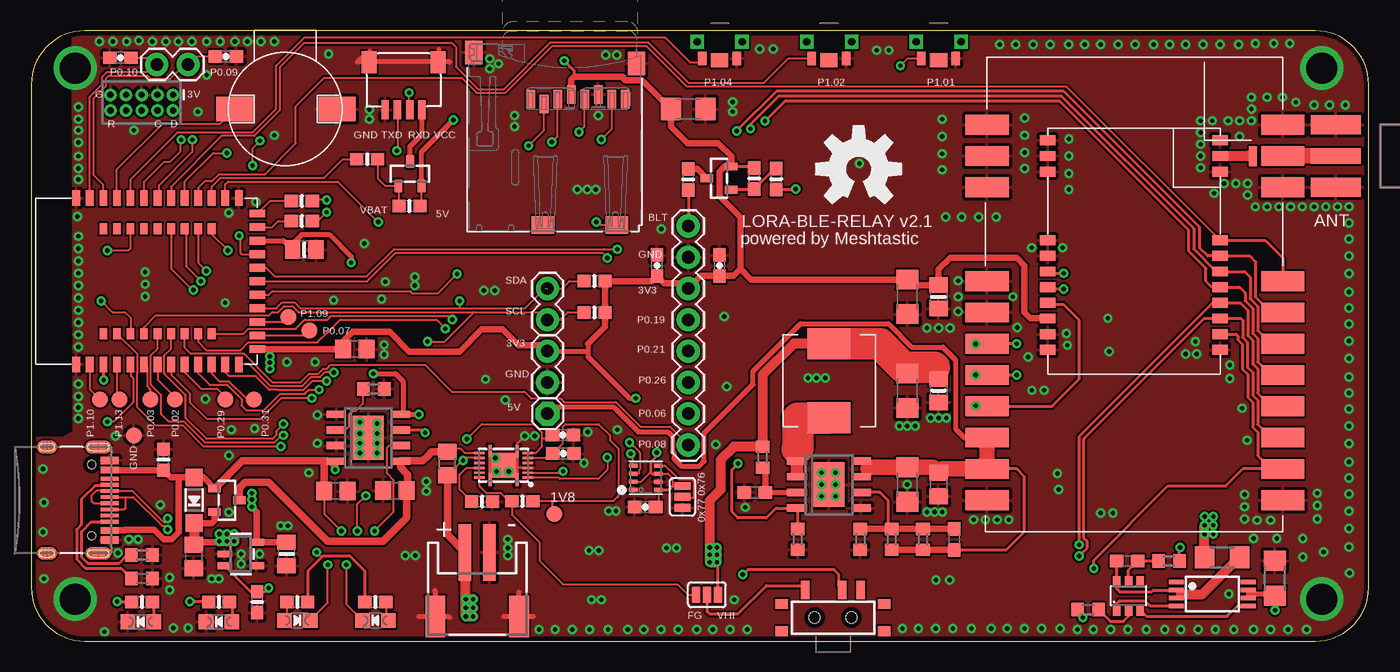
[diagram p3: board, top side]
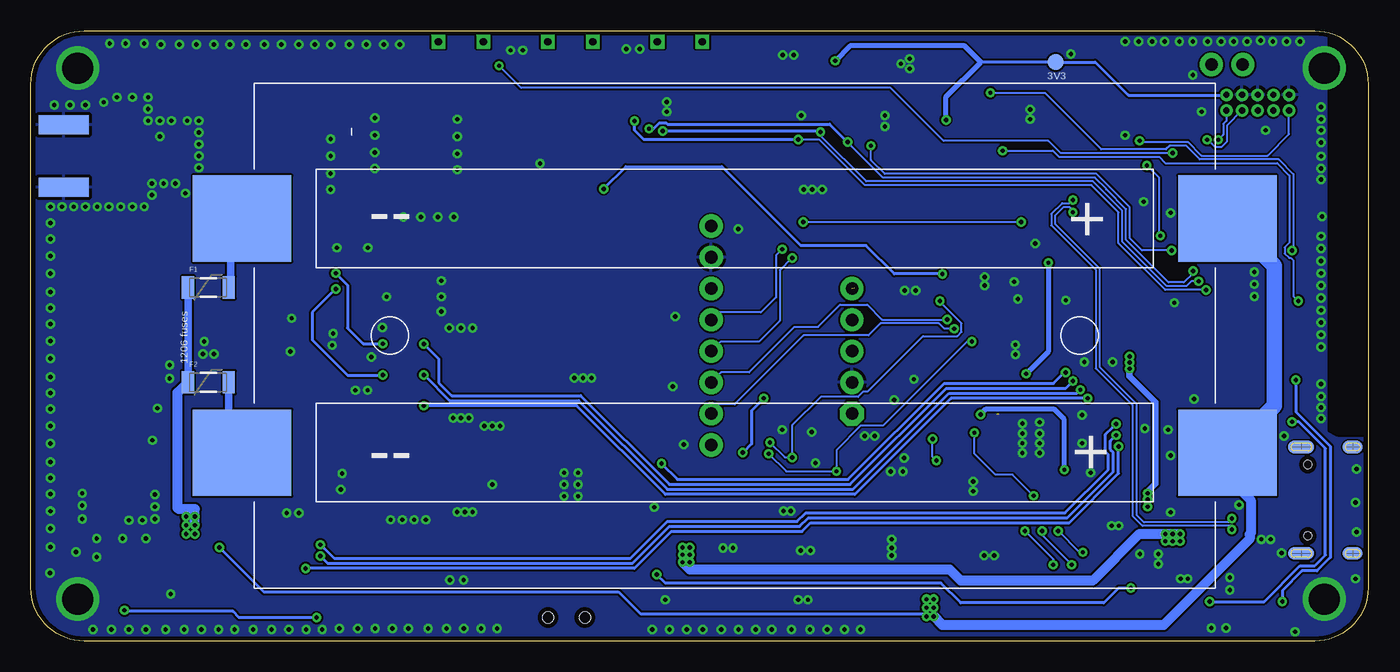
[diagram p4: board, bottom side, seen from below]

Size 108.58 x 49.53 mm. Coordinates in mm from the lower left corner, seen from the top.
Outline: 108.58,4.34 108.58,45.19 arc90 104.25,49.53 4.34,49.53 arc90 0,45.19 0,4.34 arc90 4.34,0 104.25,0 arc90 108.58,4.34
Copper layers (1*16): Top 0.035mm / dielectric 1.5mm / Bottom 0.035mm
Design rules "default *": minimum track width 6mil, minimum drill 0.35mm, track to track 6mil, track to pad 6mil, pad to pad 6mil, via to via 6mil, smd to smd 6mil, copper to edge 15mil, drill to drill 6mil, minimum pad ring 10mil, minimum via ring 8mil, stop-mask expansion 4mil, vias tented up to drill 20mil, thermal gap 10mil

### Footprints (pad centres in the part's own frame; a part is rotated, then mirrored left to right if it is on the bottom)
TP13R = smd 1.3 x 1.3: TP 0,0
SMA_EDGELAUNCH = smd 4.064 x 1.524: GND@1 2.032,-2.54; GND@2 2.032,2.54 | smd 4.064 x 1.524 bottom: GND@3 2.032,2.54; GND@4 2.032,-2.54 | smd 4.064 x 1.27: P 2.032,0
C0805 = smd 1.3 x 1.5: 1 -0.95,0; 2 0.95,0
C1206 = smd 1.6 x 1.8: 1 -1.4,0; 2 1.4,0
C0603 = smd 1.1 x 1: 1 -0.85,0; 2 0.85,0
0603-CAP = smd 1.1 x 1: 1 -0.85,0; 2 0.85,0
0805-NO = smd 1.24 x 1.5: 1 -0.95,0; 2 0.95,0
SOD-123 = smd 1.4 x 1.4: A 1.85,0; C -1.85,0
CHIPLED_0805_NOOUTLINE = smd 1.2 x 1.2: A 0,-1.05; C 0,1.05
LS12T2 = smd 1.1 x 0.7: 1 0,1.4; 2 0,-1.4 | smd 1.1 x 1.4: FRAME -0.15,0 | drill 0.6 pad 1.016 square: P$4 1.35,-1.825; P$5 1.35,1.825
PTC-1206-WIDE = smd 1 x 1.8: 1 -1.654,0; 2 1.654,0
USB-C-16P = smd 0.3 x 1.45: A5 -1.25,0; A6 -0.25,0; A7 0.25,0; A8 1.25,0; B5 1.75,0; B6 0.75,0; B7 -0.75,0; B8 -1.75,0 | smd 0.6 x 1.45: GND -3.225,0; GND2 3.225,0 | smd 1 x 2.1: SHLD1 -4.32,-0.915; SHLD2 4.32,-0.915 | smd 1 x 2.1 bottom: SHLD3 -4.32,-0.915; SHLD4 4.32,-0.915 | smd 1 x 1.6: SHLD5 -4.32,-5.095; SHLD8 4.32,-5.095 | smd 1 x 1.6 bottom: SHLD6 -4.32,-5.095; SHLD7 4.32,-5.095 | smd 0.55 x 1.45: VBUS1 -2.45,0; VBUS2 2.45,0 | hole 0.65: -2.89,-1.445; 2.89,-1.445
2X5-PTH-1.27MM-NO_SILK = drill 0.508 pad 1: 1 -2.54,-0.635; 2 -2.54,0.635; 3 -1.27,-0.635; 4 -1.27,0.635; 5 0,-0.635; 6 0,0.635; 7 1.27,-0.635; 8 1.27,0.635; 9 2.54,-0.635; 10 2.54,0.635
1X08_ROUND = drill 1.016 pad 1.88: 1 0,0; 2 2.54,0; 3 5.08,0; 4 7.62,0; 5 10.16,0; 6 12.7,0; 7 15.24,0; 8 17.78,0
1X02 = drill 1.016 pad 1.88: 1 0,0; 2 2.54,0
1X01 = drill 1.016 pad 1.93 octagon: 1 0,0
SOT23-R = smd 0.635 x 1.016: 1 -0.95,-1; 2 0.95,-1; 3 0,1
0603-NO = smd 1.075 x 1: 1 -0.85,0; 2 0.85,0
R0603 = smd 1 x 1.1: 1 -0.85,0; 2 0.85,0
R0805 = smd 1.3 x 1.5: 1 -0.95,0; 2 0.95,0
R1206 = smd 1.6 x 1.803: 1 -1.422,0; 2 1.422,0
SJ_3 = smd 0.635 x 1.27: 1 -0.889,0; 2 0,0; 3 0.889,0
PDSO-N12 = smd 0.2 x 0.85: 1 -1,-1.975; 2 -0.6,-1.975; 3 -0.2,-1.975; 4 0.2,-1.975; 5 0.6,-1.975; 6 1,-1.975; 7 1,1.975; 8 0.6,1.975; 9 0.2,1.975; 10 -0.2,1.975; 11 -0.6,1.975; 12 -1,1.975 | smd 1.95 x 1.95: EP 0,0 | smd 1 x 0.25: EP1 -1.15,1.1; EP2 -1.15,-1.1; EP3 1.15,-1.1; EP4 1.15,1.1
SOT23-5 = smd 0.55 x 1.2: 1 -0.95,-1.3; 2 0,-1.3; 3 0.95,-1.3; 4 0.95,1.3; 5 -0.95,1.3
BME280 = smd 0.7 x 0.35: 1 1.025,0.975; 2 1.025,0.325; 3 1.025,-0.325; 4 1.025,-0.975; 5 -1.025,-0.975; 6 -1.025,-0.325; 7 -1.025,0.325; 8 -1.025,0.975
BUZZER = smd 3 x 2: P$1 0,0; P$2 8.3,0
2X18650 = smd 8 x 7: B1+ 0,0; B1- 80,0; B2+ 0,19; B2- 80,19
NRF52840MOD = smd 1.27 x 0.635: 1 0,14.7; 2 0,13.6; 3 0,12.5; 4 0,11.4; 5 0,10.3; 6 0,9.2; 7 0,8.1; 8 0,7; 9 0,5.9; 10 0,4.8; 11 0,3.7; 12 0,2.6; 13 0,1.5; 32 13.5,14.7; 33 13.5,13.6; 34 13.5,12.5; 35 13.5,11.4; 36 13.5,10.3; 37 13.5,9.2; 38 13.5,8.1; 39 13.5,7; 40 13.5,5.9; 41 13.5,4.8; 42 13.5,3.7; 43 13.5,2.6; 44 13.5,1.5; P$7 0,8.1; P$32 13.5,8.1 | smd 0.9 x 0.635: 14 2.5,12.5; 15 2.5,11.4; 16 2.5,10.3; 17 2.5,9.2; 18 2.5,8.1; 19 2.5,7; 20 2.5,5.9; 21 2.5,4.8; 22 2.5,3.7; 23 11,12.5; 24 11,11.4; 25 11,10.3; 26 11,9.2; 27 11,8.1; 28 11,7; 29 11,5.9; 30 11,4.8; 31 11,3.7 | smd 0.635 x 1.27: 45 12.25,0; 46 11.15,0; 47 10.05,0; 48 8.95,0; 49 7.85,0; 50 6.75,0; 51 5.65,0; 52 4.55,0; 53 3.45,0; 54 2.35,0; 55 1.25,0
SX1262-30DBM = smd 3.5 x 1.6: ANT 0,2.54; BUSY 0,25.4; DIO1 0,27.94; DIO2 24,22.86; GND 24,0; GND2 24,2.54; GND3 24,5.08; GND4 24,12.7; GND5 24,15.24; GND6 24,30.48; GND7 0,30.48; GND8 0,5.08; GND9 0,0; MISO 0,20.32; MOSI 0,17.78; NRST 0,22.86; NSS 0,12.7; RXEN 24,17.78; SCK 0,15.24; TXEN 24,20.32; VCC 24,25.4; VCC2 24,27.94
JST-SH-3 = smd 0.6 x 1.55: 1 1.3,3.875; 2 2.3,3.875; 3 3.3,3.875; 4 4.3,3.875 | smd 1.2 x 1.8: HL 5.6,0; HR 0,0
7.5MM_COIL = smd 2.5 x 3.5: P$1 0,0; P$2 6,0
SX1262_EBYTE = smd 1.27 x 0.8: 1 14,0; 2 14,1.27; 3 14,2.54; 4 14,8.11; 5 14,9.38; 6 14,10.65; 7 14,11.92; 8 14,13.19; 9 14,14.46; 10 14,15.73; 11 14,17; 12 0,17; 13 0,15.73; 14 0,14.46; 15 0,13.19; 16 0,11.92; 17 0,10.65; 18 0,9.38; 19 0,8.11; 20 0,2.54; 21 0,1.27; 22 0,0
SOT23-6 = smd 0.6 x 0.9: 1 -0.95,-1.15; 2 0,-1.15; 3 0.95,-1.15; 4 0.95,1.15; 5 0,1.15; 6 -0.95,1.15
G5177C_SO-08 = smd 0.6 x 1.6: 1 -1.905,-2.6; 2 -0.635,-2.6; 3 0.635,-2.6; 4 1.905,-2.6; 5 1.905,2.6; 6 0.635,2.6; 7 -0.635,2.6; 8 -1.905,2.6 | smd 3.6 x 2.5: PAD 0,0
SOLDERPAD = smd 0.635 x 1.6: P$1 0,0
KPS-1290 = smd 0.7 x 1.5: O -2.25,2.25; P 0.75,2.25; S 2.25,2.25 | smd 1 x 0.8: P$1 -4.15,1.1; P$2 -4.15,-1.1; P$3 4.15,-1.1; P$4 4.15,1.1 | hole 0.9: -1.5,0; 1.5,0
TSSOP8 = smd 1.2 x 0.35: 1 -2.925,0.975; 2 -2.925,0.325; 3 -2.925,-0.325; 4 -2.925,-0.975; 5 2.925,-0.975; 6 2.925,-0.325; 7 2.925,0.325; 8 2.925,0.975
TP4056BETTER_SO-08 = smd 0.6 x 1.6: 1 -1.905,-2.6; 2 -0.635,-2.6; 3 0.635,-2.6; 4 1.905,-2.6; 5 1.905,2.6; 6 0.635,2.6; 7 -0.635,2.6; 8 -1.905,2.6 | smd 3.6 x 2.5: P$1 0,0
JSTPH2 = smd 1 x 4.6: 1 -1,-3.7; 2 1,-3.7 | smd 1.6 x 3.4: NC1 -3.4,1.5; NC2 3.4,1.5
MICROSD = smd 0.7 x 1.5: 1 9,-10.64; 2 7.9,-10.24; 3 6.8,-10.64; 4 5.7,-11.04; 5 4.6,-10.64; 6 3.5,-11.04; 7 2.4,-10.64; 8 1.3,-10.64 | smd 1.8 x 1.4: CD1 2,-0.44; CD2 8,-0.44 | smd 1.4 x 1.9: MT1 0.4,-13.54; MT2 13.6,-14.44

### Placement (x,y rotation side)
1V8  42.47,10.3 0 top
3V3  25.36,46.99 0 bottom
ANT  107.95,39.37 180 top
C1  29.5,12.2 180 top
C2  71.12,12.7 270 top
C3  88.97,6.5 180 top
C4  43.18,15.21 0 top
C5  43.17,16.72 0 top
C6  73.66,27.94 90 top
C7  73.66,20.32 90 top
C8  20.72,7.07 90 top
C9  24.74,12.17 0 top
C10  22.16,31.77 180 top
C11  50.8,30.48 90 top
C12  55.88,30.48 90 top
C13  13.2,6.87 270 top
C14  7.22,47.35 180 top
C15  73.66,12.7 270 top
C16  71.12,20.32 270 top
C17  58.74,12.06 180 top
C18  74.93,8.26 90 top
C19  15.8,47.45 0 top
C20  71.12,27.94 270 top
C21  53.34,43.18 0 top
C22  49.83,10.89 180 top
C23  26.27,23.7 0 top
D1  13.22,11.43 90 top
D2  15.24,1.57 90 top
D3  27.94,1.67 90 top
D4  8.89,1.57 90 top
D5  21.59,1.67 270 top
DWN  55.88,47.29 90 top
DWN1  73.66,47.29 90 top
DWN2  64.77,47.29 90 top
F1  94.17,28.7 0 bottom
F2  94.17,21 0 bottom
G  8.32,16.69 0 top
J2  6.35,11.43 270 top
J3  8.97,43.7 180 top
JP1  53.34,15.91 90 top
JP2  10.19,46.79 0 top
JP3  41.91,18.45 0 top
JP4  41.91,23.53 270 top
JP7  41.91,28.61 270 top
P0.02  11.67,19.6 0 top
P0.03  9.67,19.6 0 top
P0.07  22.57,25.2 0 top
P0.29  15.77,19.6 0 top
P0.31  18.07,19.6 0 top
P1.09  20.87,26.3 0 top
P1.10  5.57,19.6 0 top
P1.13  7.17,19.6 0 top
Q2  30.74,37.94 0 top
Q3  15.88,11.43 270 top
Q4  55.84,37.57 90 top
R1  30.7,35.3 180 top
R2  10.73,14.72 270 top
R3  21.59,3.17 0 top
R4  27.8,20.46 180 top
R5  33.78,14.39 90 top
R6  45.72,26.67 0 top
R7  27.94,3.17 180 top
R8  85.8,2.55 0 top
R9  45.72,29.21 0 top
R10  39.87,11.35 0 top
R11  36.6,11.32 180 top
R12  8.99,6.99 180 top
R13  8.99,5.08 180 top
R14  21.96,35.72 180 top
R15  21.96,34.08 180 top
R16  15.24,3.17 180 top
R17  8.99,3.17 180 top
R18  59.37,14.92 90 top
R19  67.31,8.26 90 top
R20  69.85,8.26 270 top
R21  72.39,8.26 270 top
R22  53.34,37.47 90 top
R23  92.37,6.5 0 top
R24  18.33,3.16 270 top
R25  62.23,8.26 90 top
R26  27.27,39.1 0 top
R27  60.47,37.5 90 top
R28  58.69,37.53 270 top
R29  100.97,5.1 270 top
R30  96.67,6.8 180 top
SJ1  54.86,3.76 0 top
SJ2  52.87,11.7 90 top
U1  38.34,14.26 90 top
U2  17.01,7.07 270 top
U3  49.89,13.26 180 top
U$2  16.51,43.18 0 top
U$7  [OSHW-LOGO-L]  67.17,38.3 0 top
U$10  11.43,34.29 180 bottom
U$14  18.35,22.45 90 top
U$15  101.6,41.91 180 top
U$17  33.02,46.99 180 top
U$35  64.77,24.13 270 top
U$36  96.52,40.64 180 top
U$38  89.08,3.67 0 top
U$39  64.77,12.7 270 top
U$41  99.17,39.35 0 top
U$45  65.09,1.91 0 top
U$46  95.88,3.81 0 top
U$47  27.37,16.5 270 top
X1  36.2,3.49 180 top
X4  49.53,33.34 180 top

### Tracks (layer width: path | path; a pad name or v marks a point on that pad's centre or on a via)
1.8V
  Top 0.152: U1.5 42.27,14.86 C4.1 43.17,16.05 43.17,17.4 43.37,17.6 46.07,17.6 46.97,16.7 46.97,16.3 47.67,15.6 47.67,11.8 47.62,11.75 | 42.27,11.35 47.22,11.35 47.62,11.75 | 42.27,11.35 R10.2 | 47.62,11.75 47.62,11.65 | 42.27,11.35 42.27,10.5 1V8.TP
3.3V  (via drill 0.35)
  Top 0.152: R1.1 31.69,35.44 Q2.2 | U3.6 51.69,13.59 52.07,13.2 52.07,12.6 | U3.2 49.51,12.94 50.29,13.72 | C22.1 50.97,11.18 50.97,12.29
  Top 0.254: v43.27,47.1 44.07,46.3 44.07,45.8 | Q4.2 58.45,38.52 R28.1 | v19.37,22.6 v19.37,22.1 | v50.77,15.3 50.77,15.01 50.29,14.53 50.29,13.72 50.27,13.7 50.39,13.59 U3.6 | U3.8 50.97,12.29 51.76,12.29 52.07,12.6 52.86,12.6 SJ2.3
  Top 0.406: v17.91,12 v17.91,11.5 v17.91,10.9 | 45.2,24.13 45.2,23.5 | 45.2,23.5 45.2,23.07 48.57,19.7 v49.07,19.7 | Q2.2 31.69,39.72 v34.27,42.3 | 45.2,23.5 45.17,23.53 JP4.1
  Top 0.508: U$36.9 81.13,26.18 80.64,26.67 80.64,30.48 80.01,31.11 74.61,31.11 73.66,30.16 C6.2 71.57,28.89 C20.1 58.43,29.34 57.57,30.2 | C8.2 U2.5 18.31,10.5 v17.91,10.9 | U$14.55 19.37,23.7 | 19.37,23.7 C23.1 25.32,24.35 26.07,25.1 29.07,25.1 30.67,23.5 34.77,23.5 36.57,25.3 38.27,25.3 39.57,24 41.78,24 JP4.1 | 19.37,23.7 v19.37,23.1 v19.37,22.6 | 45.2,24.13 46.57,25.5 R6.2 R9.2 50.38,29.21 C11.1 51.37,29.06 52.89,29.06 JP1.6 54.36,29.63 C12.1 57,29.63 57.57,30.2 | X4.4 43.83,45.56 44.07,45.8 47.98,45.8 48.26,45.52 49.6,45.52 C21.1 51.94,41.73 53.27,40.4 55.77,40.4 56.84,39.34 Q4.2 56.29,38.52 55.87,38.1 55.87,36.1 57.57,34.4 57.57,30.2
  Bottom 0.254: 31.46,46.99 3V3.TP 22.16,46.99 19.47,44.3 11.54,44.3 J3.1 | v49.07,19.7 50.07,18.7 50.07,16 v50.77,15.3
  Bottom 0.406: v43.27,47.1 42.07,48.3 32.77,48.3 31.46,46.99 34.27,44.18 v34.27,42.3
  Bottom 0.508: v19.37,23.1 19.37,21.5 17.27,19.4 17.27,12.77 17.91,12.12 v17.91,10.9
5V
  Top 0.254: C18.1 79.16,7.41 80.64,8.89 80.64,13.34 80.01,13.97 U$15.VCC2 | U$39.7 68.08,14.04 | U$39.8 67.88,14.1 68.08,14.1
  Top 0.406: U$15.VCC 75.77,16.5 75.03,17.24 75.03,22.84 74.02,23.85 71.48,23.85 69.57,25.76 62.45,25.76 58.61,21.92 58.61,20.84 54.64,16.86 54.64,14.57 54.26,14.2 52.77,14.2 52.17,14.8 52.17,15.25 52.05,15.37 52.05,16.61 51.69,16.97 49.29,16.97 47.29,18.97 42.43,18.97 JP3.1
  Top 0.508: 67.57,14.61 68.08,14.1 68.08,14.04 | R20.2 R21.2 C18.1
  Top 1.27: U$15.VCC U$15.VCC2 73.98,13.97 C15.1 73.21,14.1 C2.1 68.08,14.1 67.94,13.97
ANT
  Top 1.27: U$15.ANT ANT.P
BATT-
  Top 0.254: C3.2 U$38.6 88.13,4.24 88.37,4 90.97,4 91.1,4.13 U$46.2 93.33,4.13 93.37,3.8 93.35,3.48 U$46.3
  Top 0.813: R30.1 95.09,3.8 93.37,3.8
BATTERY_IN  (via drill 0.35)
  Top 0.152: U1.8 35.23,14.86 34.87,14.5 | R5.1 33.82,13.45 34.87,14.5 | 34.87,14.5 34.91,14.5 v35.06,14.65 | v35.37,16.4 36.57,17.6 40.79,17.6 41.48,16.91 41.48,16.4 | U1.6 40.36,15.3 40.97,15.3 41.48,15.81 41.48,16.4 | C5.1 42.32,16.4 41.48,16.4
  Top 0.254: R23.2 93.22,7.55 v93.27,7.6
  Top 0.61: X1.2 33.78,8.61 R5.1
  Top 0.813: v35.27,2.7 v35.27,2 v35.87,2 | v35.27,2.7 v35.27,3.4 | v35.27,3.4 35.27,7.12 X1.2 | v35.87,3.4 v35.27,3.4 | v35.87,2.7 v35.27,2.7
  Bottom 0.152: v35.06,14.65 35.37,14.96 v35.37,16.4
  Bottom 0.254: v93.27,7.6 89.67,4 60.87,4 59.07,2.2 36.07,2.2 v35.87,2
  Bottom 0.813: U$10.B2+ 13.68,15.29 13.97,15 | U$10.B2+ 13.56,15.29 13.97,15.7 | U$10.B2+ 12.86,15.29 13.97,16.4 | U$10.B2+ 13.66,15.29 | U$10.B2+ 11.43,13.33 9.54,11.44 9.54,8.72 9.62,8.64 9.62,8.3 16.62,1.3 34.57,1.3 v35.27,2
  Bottom 1.27: U$10.B2+ 7.62,19.1 7.62,30.48 U$10.B1+
BLT  (via drill 0.35)
  Top 0.152: U$14.51 19.27,28.1 19.57,28.4 30.73,28.4 30.89,28.25 33.02,28.25 v34.57,29.8
  Top 0.254: R27.1 61.92,36.65 v62.07,36.7
  Bottom 0.254: v34.57,29.8 38.47,29.8 40.77,32.1 46.07,32.1 52.47,38.5 60.27,38.5 v62.07,36.7
BOOST_EN  (via drill 0.35)
  Top 0.152: v24.57,21.8 23.81,21.8 23.42,21.41 22.68,21.41 21.98,20.7 19.45,20.7 17.7,22.45 U$14.13
  Top 0.254: v57.37,14.4 56.87,13.9 56.87,10.5 57.37,10 59.67,10 60.47,10.79 U$39.4 62.23,10.73 R25.2
  Top 0.508: R25.2 62.17,9.16
  Bottom 0.254: v57.37,14.4 56.09,13.12 42.23,13.12 34.43,20.92 25.55,20.92 24.67,21.8 v24.57,21.8
BTN_OK
  Top 0.152: U$14.36 8.05,37.48 11.87,41.3 17.97,41.3 19.87,43.2 19.87,46.7 22.17,49 51.47,49 53.48,46.99 54.18,46.99 DWN.1
BTN_UP  (via drill 0.35)
  Top 0.152: U$14.40 12.47,35.97 12.47,37.3 14.77,39.6 v15.87,39.6 16.07,39.6 | DWN1.1 71.16,47.29 v70.57,46.7
  Bottom 0.152: 70.27,46.4 v70.57,46.7 68.77,44.9 38.77,44.9 34.47,40.6 25.97,40.6 24.97,39.6 v15.87,39.6
BUSY  (via drill 0.35)
  Top 0.152: v20.47,16.71 20.32,16.71 19.72,16.11 14.1,16.11 12.4,17.8 11.16,17.8 10.55,18.42 10.55,19.96 9.7,20.81 9.7,23.18 10.25,23.73 U$14.18
  Top 0.254: U$15.BUSY 100.65,16.51 99.57,17.59 99.57,19.55 99.16,19.96 99.16,21.81 98.74,22.23 98.74,24.25 98.35,24.64 98.35,26.04 98.21,26.18 U$36.14 95.25,26.18 85.48,16.41 85.48,8.33 85.73,8.08 85.73,7.54 85.34,7.15 85.32,7.15 v85.07,6.9
  Bottom 0.254: v85.07,6.9 84.48,6.31 59.74,6.31 56.74,9.31 46.16,9.31 45.46,10.01 24.44,10.01 20.71,13.74 20.71,15.31 20.93,15.53 20.93,16.25 v20.47,16.71
BUZZER
  Top 0.152: U$14.35 6.95,38.28 10.67,42 15.33,42 U$2.P$1
CC1
  Top 0.254: J2.A5 6.28,12.61 5.18,12.61 4.07,11.5 4.07,9.46 3.67,9.05 3.67,6.65 4.39,5.92 7.3,5.92 R13.2
CC2
  Top 0.254: R12.2 7.8,6.99 7.14,6.33 4.56,6.33 4.07,6.82 4.07,8.88 4.87,9.68 J2.B5
D_CS
  Top 0.152: U$14.20 12.45,23.82 12.96,23.31 17.26,23.31 19.57,21 21.85,21 22.56,21.71 23.29,21.71 23.69,22.11 24.02,22.11 24.32,22.41 31.96,22.41 34.13,20.24 40.03,20.24 40.57,19.7 42.95,19.7 43.25,19.4 47.47,19.4 49.47,17.4 51.87,17.4 53.34,15.93 JP1.1
D_RES  (via drill 0.35)
  Top 0.152: U$14.21 13.55,24.28 14.21,23.62 16.99,23.62 17.62,24.25 23.22,24.25 24.01,25.04 24.04,25.04 25.09,26.08 32.89,26.08 v33.62,25.35
  Bottom 0.152: v33.62,25.35 34.42,25.35 34.85,25.78 39.59,25.78 40.57,24.8 45.84,24.8 51.44,19.2 53.07,19.2 53.34,18.93 JP1.2
D_RS  (via drill 0.35)
  Top 0.152: U$14.22 17.22,24.95 17.62,25.35 21.47,25.35 22.21,26.08 24.05,26.08 24.36,26.39 33.87,26.39 v34.17,26.09
  Bottom 0.152: JP1.3 52.53,21.8 50.27,21.8 46.57,25.5 44.67,25.5 42.87,27.3 40.67,27.3 39.46,26.09 v34.17,26.09
DIO1  (via drill 0.35)
  Top 0.152: U$14.15 8.6,23.3 8.6,21.72 8.57,21.69 8.57,19 10.07,17.5 12.27,17.5 13.97,15.8 v20.27,15.8
  Top 0.254: U$36.13 97.8,24.91 97.94,24.77 97.94,24.47 98.34,24.08 98.34,22.06 98.75,21.64 98.75,19.79 99.16,19.38 99.16,17.36 99.57,16.95 99.57,15.05 100.65,13.97 U$15.DIO1 98.37,13.97 97,12.6 92.29,12.6 86.27,6.58 v86.27,5.9
  Bottom 0.254: v86.27,5.9 59.57,5.9 56.57,8.9 45.97,8.9 45.27,9.6 24.27,9.6 20.27,13.6 v20.27,15.8
DIO2  (via drill 0.35)
  Top 0.152: v22.77,19.7 20.27,19.7 18.62,18.05 | 18.57,18 18.62,18.05 | U$14.8 11.37,22.43 11.37,21.6 12.87,20.1 12.87,19.4 14.22,18.05 18.62,18.05
  Top 0.254: U$36.8 83.04,27.45 83.19,27.3 83.82,27.3 85.09,26.04 85.09,21.27 82.87,19.05 U$15.DIO2 76.72,19.05 v76.67,19.1
  Bottom 0.254: v22.77,19.7 33.87,19.7 41.67,11.9 57.07,11.9 64.27,19.1 v76.67,19.1
DISP_CLK  (via drill 0.35)
  Top 0.152: U$14.50 27.27,29.2 29.57,31.5 46.37,31.5 v46.77,31.1
  Bottom 0.152: v46.77,31.1 47.77,30.1 47.77,26 49.47,24.3 52.57,24.3 JP1.4
DISP_SDA  (via drill 0.35)
  Top 0.152: U$14.49 19.07,30.3 19.77,29.6 27.24,29.6 29.44,31.8 46.5,31.8 v47.57,31.8
  Bottom 0.152: v47.57,31.8 48.08,31.3 48.08,27.9 49.3,26.67 52.74,26.67 JP1.5
FB
  Top 0.254: 69.53,9.11 69.53,11.43 68.9,12.06 U$39.6
  Top 0.508: C18.2 R21.1 R20.1 69.53,9.11 R19.2
GGGG
  Top 0.254: Q4.1 56.9,36.69 R28.2 60.35,38.35 R27.2
GND  (via drill 0.35, 2.5)
  Top 0.152: U1.EP1 37.24,13.22 v37.78,13.76 | U1.EP4 37.24,15.29 v37.68,14.86 | U1.EP2 38.81,13.74 | 38.81,13.74 38.8,13.76 v38.78,13.76 | 39.13,14.06 39.44,14.37 U1.EP3 39.44,16.02 v40.08,16.66 | U1.3 39.13,14.06 | 39.13,14.06 38.81,13.74
  Top 0.254: U$47.P$1 27.72,16.5 v28.08,16.86
  Top 0.406: 31.47,2 33.87,2 33.97,1.9 | 38.37,2 40.77,2 | 32.77,4.1 32.77,3.6 | 39.57,4 39.57,3.5 | 33.97,47 33.07,47 | 33.07,47 26.47,47 27.07,47.6 27.47,47.6 27.47,47.9 | 33.07,48 33.07,47
  other vias: 75.25,27.94 79.69,27.94 72.71,25.4 73.66,25.4 74.61,25.4 64.15,11.75 65.29,11.75 64.15,12.7 65.29,12.7 64.15,13.65 65.29,13.65 70.48,17.46 71.12,17.46 73.02,18.1 73.66,18.1 74.3,18.1 71.75,17.46 72.71,10.48 73.34,10.48 73.98,10.48 71.12,12.7 76.52,9.84 77.47,9.84 78.42,9.84 79.38,9.84 107,35.24 106.05,35.24 105.09,35.24 104.14,35.24 103.19,35.24 102.23,35.24 101.28,35.24 100.33,35.24 99.38,35.24 98.74,36.2 98.74,37.15 97.79,37.15 96.84,37.15 94.93,38.42 94.93,39.37 94.93,40.32 94.93,41.27 94.93,42.23 95.88,42.23 97.16,42.23 98.11,42.23 99.06,42.23 99.06,43.18 99.06,44.13 98.11,40.96 100.33,44.13 101.6,44.13 102.67,43.73 104.14,43.5 105.41,43.5 106.68,43.5 7.94,8.26 6.82,16.66 8.68,8.26 3.84,23.86 3.84,37.45 37.24,47.26 37.24,46.45 37.94,46.85 27.44,42.35 27.44,43.16 7.04,7.16 10.48,11.05 97.31,22.4 97.31,21.3 93.71,23.3 94.61,23.3 94.51,24.3 98.51,11.9 98.51,10.9 98.51,9.9 99.51,9.8 100.61,9.8 104.41,12 104.41,11 104.41,9.9 107,33.94 107,32.64 107,31.24 107,29.84 102.18,48.5 100.88,48.5 99.38,48.5 14.64,5.05 15.24,5.05 17.04,7.05 17.04,6.25 18.54,7.05 3.74,34.45 3.84,20.86 18.24,35.66 16.04,34.76 28.64,24.05 28.64,23.25 20.74,22.66 23.04,22.66 46.04,42.66 59.14,48.05 26.68,17.75 28.08,17.66 26.68,16.86 26.68,16.05 28.08,16.05 28.08,15.26 26.68,15.26 40.88,16.66 47.48,10.55 55.58,15.96 20.24,9.36 20.84,9.36 3.84,19.86 3.84,18.95 3.84,18.05 0.94,13.96 0.94,8.86 1.04,11.26 3.84,24.86 3.84,25.86 3.84,26.86 3.84,27.86 3.84,28.86 3.84,29.86 3.84,30.86 3.84,31.86 3.84,32.85 3.84,38.35 3.84,39.35 3.84,40.45 3.84,41.45 3.84,42.35 3.84,43.35 14.24,45.95 13.54,42.95 13.04,48.66 14.24,48.66 22.54,13.65 16.04,10.46 47.54,47.55 46.64,47.55 39.24,42.66 39.24,41.76 107,28.34 1.04,5.05 5.94,0.76 11.54,1.05 12.74,1.05 11.24,5.16 11.24,4.16 70.73,1.03 72.03,1.03 73.43,1.03 74.83,1.03 76.33,1.03 77.93,1.03 79.23,1.03 80.63,1.03 82.03,1.03 83.53,1.03 84.93,0.93 86.23,0.93 87.63,0.93 89.03,0.93 90.53,0.93 92.03,0.93 93.33,0.93 94.73,0.93 96.13,0.93 97.63,0.93 99.23,0.93 100.63,0.93 102.03,0.93 103.53,0.93 107.03,5.53 107,13.24 107,11.94 107,10.54 107,9.14 107,7.64 107,20.14 107,18.84 107,17.44 107,16.04 107,14.54 107,27.04 107,25.74 107,24.34 107,22.94 107,21.44 78.63,48.43 79.93,48.43 81.33,48.43 82.73,48.43 84.23,48.43 85.53,48.43 86.83,48.43 88.23,48.43 89.63,48.43 91.13,48.43 92.43,48.43 93.73,48.43 95.13,48.43 96.53,48.43 98.03,48.43 73.94,38.26 73.94,39.56 73.94,40.96 73.94,42.36 80.64,38.36 80.64,39.66 80.64,41.06 80.64,42.46 74.23,34.43 75.53,34.43 76.93,34.43 78.33,34.43 84.24,36.66 84.24,37.96 84.24,39.36 84.24,40.76 84.04,24.96 80.94,23.06 80.04,25.46 81.24,20.36 82.24,20.36 41.23,0.93 42.53,0.93 43.93,0.93 45.33,0.93 46.83,0.93 48.43,0.93 49.73,0.93 51.13,0.93 52.53,0.93 54.03,0.93 55.33,0.93 56.73,0.93 58.13,0.93 5.54,48.66 6.64,48.66 7.74,48.66 8.74,48.76 9.84,48.66 10.94,48.66 11.94,48.66 15.34,48.66 16.54,48.66 17.54,48.66 18.64,48.66 19.74,48.66 97.23,3.83 103.23,6.83 104.93,7.23 101.13,8.33 84.12,24.01 45.18,16.95 44.88,14.46 46.88,10.55 47.58,17.16 45.28,7.36 46.08,7.36 51.58,7.55 52.38,7.55 45.48,3.35 46.28,3.35 30.38,6.96 31.18,6.96 9.24,29.95 9.24,28.95 9.24,27.95 28.74,29.16 27.04,32.26 15.74,27.45 36.74,28.45 37.64,28.45 63.05,21.35 63.75,21.35 64.45,21.35 44.34,36.66 45.14,36.66 45.84,36.66 19.74,41.05 24.14,47.66 56.94,43.76 56.94,42.95 38.68,8.26 38.68,7.55 38.68,6.96 32.08,12.96 32.08,12.15 16.24,17.16 31.14,29.55 31.14,28.86 38.48,19.55 36.88,21.25 57.95,10.85 73.45,4.95 74.55,4.95 86.81,10.4 87.81,10.4 98.31,18.9 98.71,16.3 83.31,13.6 83.41,12.3 87.41,26.2 87.51,23.5 56.25,26.35 56.45,20.65 57.08,3.35 18.14,17.25 16.04,15.05 96.04,36.35 99.23,8.33 103.23,8.33 3.57,46.5 3.57,3.4 104.77,3.4 104.77,46.5 24.54,27.66 28.44,27.75 14.14,19.66 8.34,41.45 68.64,47.95 69.64,47.95 60.24,48.05 23.24,16.05 23.24,18.36 67.24,38.76 51.15,33.45 75.25,29.24 75.25,26.74 81.23,31.93 83.73,31.93
  pour Bottom: -1.27,55.94 -1.27,54.58 3.41,49.5 3.41,16.98 2.54,16.51 -2.54,16.51 -2.54,-5.08 113.03,-5.08 113.03,55.74
  pour Top: -1.27,57.37 -1.27,55.48 3.31,50.9 3.41,16.98 2.54,16.51 -2.54,16.51 -2.54,-2.54 110.49,-2.54 110.49,57.37
GPOUT
  Top 0.152: U1.12 36.37,12.61 36.92,12.05 38.09,12.05 38.79,11.35 R10.1 39.02,10.25 41.27,8 41.27,6.5 43.17,4.6 52.47,4.6 53.31,3.76 SJ1.1
GPS_ON
  Top 0.152: U$14.42 14.65,36.88 15.37,37.6 23.77,37.6 25.27,39.1 R26.1
L_RST  (via drill 0.35)
  Top 0.152: v20.47,17.62 19.86,17.01 19.86,16.7 19.57,16.41 14.22,16.41 12.55,18.08 12.55,19.96 10.8,21.71 10.8,23.18 11.35,23.73 U$14.19
  Top 0.254: U$15.NRST 100.65,19.05 99.57,20.13 99.57,22.1 99.16,22.5 99.16,24.4 98.76,24.81 98.76,26.84 98.14,27.45 U$36.15 95.94,27.45 85.07,16.57 v85.07,7.81
  Bottom 0.254: v85.07,7.81 84.82,7.56 84.8,7.56 83.95,6.71 59.91,6.71 56.91,9.71 46.36,9.71 45.66,10.41 24.61,10.41 21.11,13.91 21.11,15.14 21.33,15.36 21.33,16.77 20.74,17.37 20.72,17.37 v20.47,17.62
L_SS
  Top 0.152: U$36.19 84.05,44.99 53.24,44.99 49.94,48.3 42.3,48.3 38.5,44.49 36.14,44.49 34.94,45.7 23.77,45.7 21.47,43.4 21.47,40.4 18.97,37.91 15.24,37.91 14.64,37.3 14.07,37.3 13.55,36.78 U$14.41
  Top 0.254: U$36.19 100.19,32.53 101.6,31.11 U$15.NSS
LED1  (via drill 0.35)
  Top 0.152: U$14.5 8.05,21.52 8.27,21.3 8.27,19.39 6.67,17.8 v6.17,17.8
  Top 0.254: R16.2 13.2,3.17 v12.87,3.2
  Bottom 0.254: v12.87,3.2 8.45,3.2 5.54,6.11 4.34,6.11 3.48,6.97 3.48,15.63 5.64,17.8 v6.17,17.8
LED2  (via drill 0.35)
  Top 0.254: U$14.3 5.85,21.22 v5.87,21.2 | v6.97,3.2 6.99,3.17 R17.2
  Bottom 0.254: v5.87,21.2 5.87,18.6 3.07,15.8 3.07,6.8 4.17,5.7 5.37,5.7 6.97,4.1 v6.97,3.2
MISO  (via drill 0.35)
  Top 0.152: U$14.28 11.35,30.22 13.07,28.5 v13.17,28.5 | v46.27,40.7 47.13,41.56 X4.7
  Top 0.254: U$15.MISO 100.65,21.59 99.57,22.67 99.57,24.57 99.16,24.98 99.16,27 98.56,27.6 98.56,28.26 98.1,28.72 U$36.16 95.85,28.72 95.37,29.2 95.37,30.25 93.96,31.66 93.96,33.33 83.49,43.8 61.18,43.8 v59.57,42.2
  Bottom 0.152: v13.17,28.5 16.47,28.5 20.27,32.3 20.27,34.8 22.47,37 40.87,37 44.57,40.7 v46.27,40.7
  Bottom 0.254: v59.57,42.2 59.57,41.48 58.8,40.7 v46.27,40.7
MOSI  (via drill 0.35)
  Top 0.152: U$14.30 13.55,30.7 v14.21,30.04 | v42.27,40.5 42.73,40.96 X4.3
  Top 0.254: U$15.MOSI 100.65,24.13 99.57,25.21 99.57,27.17 98.97,27.77 98.97,29.53 98.51,29.99 U$36.17 96.2,29.99 94.37,31.82 94.37,33.5 83.64,44.23 60.68,44.23 58.39,41.94 v58.39,41.59
  Bottom 0.152: v14.21,30.04 14.21,29.87 14.97,29.11 16.22,29.11 19.66,32.55 19.66,35.05 21.27,36.66 21.27,36.7 22.18,37.61 39.38,37.61 v42.27,40.5
  Bottom 0.254: v58.39,41.59 58.02,41.59 57.54,42.06 57,42.06 56.9,41.96 43.73,41.96 v42.27,40.5
N$1
  Top 0.152: R3.1 20.74,1.47 D5.A
N$2
  Top 0.508: R22.2 54.09,38.31 Q4.3
N$3
  Top 0.254: SJ1.2 54.86,2.42 55.07,2.2 57.37,2.2 59.67,4.5 62.49,4.5 U$45.O
N$4
  Top 0.254: R22.1 JP1.8
N$5
  Top 0.152: R26.2 28.12,37.55 28.73,36.94 29.77,36.94 | 29.77,36.94 Q2.1 | R1.2 29.86,36.85 29.77,36.94
N$6
  Top 0.152: U$14.45 19.37,35.72 R14.2
N$7
  Top 0.152: U$14.46 19.57,33.6 20.05,34.08 R15.2
N$8
  Top 0.152: R7.1 28.79,1.47 D3.A
N$9
  Top 0.254: U$46.4 90.86,2.83 90.45,3.25 88.32,3.25 88.13,3.06 U$38.1
N$10
  Top 0.152: U$47.2 25.5,17.14 25.8,17.43 25.8,18.43 26.07,18.7 26.37,18.7 26.95,19.29 R4.2
N$11  (via drill 0.35)
  Top 0.152: v27.87,8.94 29.43,10.5 29.43,13.04 28.87,13.61 28.87,15.7 29.04,15.87 U$47.6 | v25.57,6.2 25.57,2.99 D3.C
  Bottom 0.152: v27.87,8.94 25.57,6.63 v25.57,6.2
N$12  (via drill 0.35)
  Top 0.152: D5.C 24.07,3.1 v24.07,6.2 | v26.47,8.94 26.47,11.1 v27.17,11.8
  Top 0.254: 30.04,17.2 U$47.7 31.73,17.14 v31.97,16.9
  Bottom 0.152: v24.07,6.2 26.47,8.6 v26.47,8.94 | v27.17,11.8 28.87,13.5 30.27,13.5 31.97,15.2 v31.97,16.9
N$13
  Top 0.254: R16.1 16.29,2.98 D2.A
N$14
  Top 0.254: R17.1 9.94,3.08 D4.A
N$15
  Top 0.406: Q2.3 30.74,40.17 31.72,41.15 U$17.1
N$16
  Top 0.406: C17.1 U$39.3
  Top 0.508: C17.1 59.59,13.86 R18.1
N$17
  Top 0.406: 62.23,14.66 U$39.1 | 62.17,13.8 U$39.2
  Top 1.016: 62.17,15.6 U$39.1 62.17,13.8
  Top 2.54: U$35.P$2 64.74,18.1 62.23,18.1 62.23,15.66 62.17,15.6
N$18
  Top 0.254: U$38.3 90.55,2 97.07,2 97.91,2.83 U$46.5
N$19
  Top 0.254: U$38.5 89.08,5.76 C3.1 R23.1
N$20
  Top 0.61: 98.77,39.4 U$41.P$1
  Top 0.813: U$36.21 98.74,39.37 98.77,39.4
N$21
  Bottom 0.61: F1.2 92.37,28.85 92.37,33.35 U$10.B1-
N$22
  Bottom 0.61: F2.2 92.52,16.65 91.43,15.56 U$10.B2-
N$23
  Top 0.254: R8.2 87.6,1.6 88.67,1.6 89.08,2.01 U$38.2
N$24  (via drill 0.35)
  Top 0.254: v100.97,2.5 101.17,2.7 R29.2
  Top 0.406: U$46.7 98.81,3.8 | 98.81,3.8 U$46.6 | R29.2 100.59,3.68 100.47,3.8 98.81,3.8 | R8.1 85.37,2.13 v85.37,1.9
  Bottom 0.254: v85.37,1.9 91.67,1.9 92.17,2.4 100.87,2.4 v100.97,2.5
N$25
  Top 0.152: U3.5 51.44,14.23 51.78,13.89 51.81,13.89 52.57,13.13 53.6,13.13 53.77,12.96 53.77,11.6 52.97,11.6 SJ2.2
N$26
  Top 0.152: U$14.7 10.25,21.22 11.67,19.8 P0.02.TP
N$27
  Top 0.152: U$14.6 9.4,22.2 9.4,20.68 9.67,20.41 P0.03.TP
N$28
  Top 0.152: U$14.2 4.75,20.42 P1.10.TP
N$29
  Top 0.152: U$14.4 6.95,19.82 P1.13.TP
N$30
  Top 0.152: U$14.11 14.65,21.72 15.26,21.11 16.04,21.11 17.44,19.7 P0.31.TP
N$31
  Top 0.152: U$14.9 12.45,21.82 13.78,20.5 15.07,20.5 15.77,19.8 P0.29.TP
N$32
  Top 0.152: U$14.53 20.47,25.9 P1.09.TP
N$33
  Top 0.152: U$14.54 22.17,24.8 P0.07.TP
N$34  (via drill 0.35)
  Top 0.813: R30.2 95.25,9.38 v95.27,9.4
  Bottom 0.305: v95.27,10.1 v95.97,10.1 v95.97,9.4 v95.27,9.4 v95.27,8.7 v95.97,8.7
  Bottom 0.61: F2.1 F1.1
  Bottom 0.813: v95.27,9.4 95.27,10.7 96.57,10.7 96.67,10.8 96.67,20.15 F2.1
NFC1
  Top 0.152: 5.87,35.97 U$14.34 5.85,37.02 5.07,37.8 5.07,44.06 6.06,45.05 6.06,45.5 6.06,45.66 6.29,45.88 7.85,45.88 7.87,45.9 9.43,45.9 9.71,45.62 11.29,45.62 12.46,46.79 JP2.2 13.39,47.45 C19.1
NFC2
  Top 0.152: 9.98,46.79 JP2.1 | 9.98,46.79 9.42,47.35 C14.1 8.02,47.35 | U$14.33 4.75,44.17 5.76,45.18 5.76,45.79 6.17,46.2 7.74,46.2 9.39,46.2 9.98,46.79
NRF_RST  (via drill 0.35)
  Top 0.152: v16.87,32.9 16.97,32.8 16.97,31.5 17.07,31.4 U$14.48 | v17.97,38.6 17.97,40 v18.57,40.6
  Bottom 0.152: v16.87,32.9 16.97,32.8 16.97,37.6 v17.97,38.6 | v18.57,40.6 18.48,40.51 14.65,40.51 13.54,39.41 8.16,39.41 6.43,41.14 J3.10
PHOLD  (via drill 0.35)
  Top 0.254: U2.3 17.82,4.01 R24.1 18.98,4.01 v19.27,4.3 | U$45.P 65.57,4.42 65.57,5.4 65.17,5.8 58.17,5.8 v57.77,5.4
  Bottom 0.254: v19.27,4.3 20.27,4.3 21.47,3.1 33.07,3.1 34.67,4.7 57.07,4.7 v57.77,5.4
RXD  (via drill 0.35)
  Top 0.152: U$17.2 30.67,43.16 v30.67,44.5 | v6.17,31.7 7.87,31.7 8.05,31.88 U$14.25
  Bottom 0.152: v30.67,44.5 26.27,44.5 21.67,39.91 16.42,39.91 16.12,40.21 14.78,40.21 13.67,39.1 7.27,39.1 6.07,37.9 6.07,31.8 v6.17,31.7
RXEN  (via drill 0.35)
  Top 0.152: U$15.RXEN 76.7,24.13 v76.67,24.1 | v23.97,21.1 22.81,21.1 22.07,20.36 20.07,20.36 20.03,20.39 19.32,20.39 18.21,21.5 16.07,21.5 15.75,21.82 U$14.12 15.87,22.33
  Top 0.254: U$36.6 82.66,29.84 v83.82,29.84 | v80.01,24.13 U$15.RXEN
  Bottom 0.254: v83.82,29.84 82.87,28.89 82.87,25.4 81.6,24.13 v80.01,24.13 | v76.67,24.1 75.47,22.9 75.47,20.98 74.41,19.91 63.93,19.91 56.73,12.71 42.06,12.71 34.26,20.51 24.56,20.51 v23.97,21.1
SCK  (via drill 0.35)
  Top 0.152: U$14.29 12.57,33.33 12.57,30.4 v13.77,29.2 | v44.47,41.31 44.93,41.77 X4.5
  Top 0.254: U$15.SCK 100.65,26.67 99.38,27.94 99.38,30.8 98.91,31.26 U$36.18 95.51,31.26 94.87,31.9 94.87,33.6 83.83,44.64 60.51,44.64 v57.27,41.4
  Bottom 0.152: v13.77,29.2 14.37,29.2 14.76,28.8 16.34,28.8 19.96,32.43 19.96,34.93 22.34,37.3 40.74,37.3 44.47,41.03 v44.47,41.31
  Bottom 0.254: v57.27,41.4 44.56,41.4 v44.47,41.31
SCL  (via drill 0.35)
  Top 0.152: U$14.17 9.15,25.48 10.12,26.45 19.32,26.45 19.57,26.7 20.02,26.7 20.51,27.18 21.23,27.18 21.72,26.7 35.92,26.7 35.94,26.67 | U1.2 43.05,13.66 v43.17,13.78 | U3.4 48.87,15.01 v48.67,15.2 | v32.17,24.3 33.57,24.3 35.94,26.67 | 35.94,26.67 41.31,26.67 JP7.2 42.94,26.07 43.57,26.7 44.84,26.7 R6.1
  Bottom 0.152: v48.67,15.2 47.25,13.78 v43.17,13.78 43.17,15.5 41.17,17.5 39.37,17.5 32.57,24.3 v32.17,24.3
SD_CS  (via drill 0.35)
  Top 0.152: U$14.31 14.65,33.02 v15.97,31.7 | v40.37,40.2 41.63,41.46 X4.2
  Bottom 0.152: v15.97,31.7 18.36,31.7 19.36,32.7 19.36,35.22 22.05,37.91 39.25,37.91 40.37,39.03 v40.37,40.2
SD_DET  (via drill 0.35)
  Top 0.152: U$14.43 15.75,37.08 15.97,37.3 24.88,37.3 v28.17,34 | v45.87,34 46.09,33.78 X4.CD1
  Bottom 0.152: v28.17,34 v45.87,34
SDA  (via drill 0.35)  (1 unrouted)
  Top 0.152: 34.77,27 40.07,27 41.7,28.62 | v34.77,27.6 34.77,27 | v46.77,14.9 46.77,13.9 46.04,13.17 42.92,13.17 42.83,13.26 U1.1 | U3.3 48.88,13.6 49.37,13.6 49.37,13.89 49.44,13.96 49.44,15.23 49.37,15.31 49.37,15.36 48.92,15.81 48.87,15.81 v48.57,16.11 | U$14.52 19.9,27 20.38,27.48 21.36,27.48 21.84,27 34.77,27 | JP7.1 43.08,28.61 43.68,29.21 R9.1
  Bottom 0.152: v34.77,27.6 34.77,27.55 33.02,25.79 33.02,25.1 33.37,24.75 36.14,24.75 40.64,20.24 41,20.24 41.43,19.82 44.45,19.82 46.77,17.5 v46.77,14.9 | 46.76,14.91 v46.77,14.9 | v48.57,16.11 47.36,14.9 v46.77,14.9
SWCLK  (via drill 0.35)
  Top 0.152: U$14.38 10.37,36.07 10.37,37 13.07,39.7 v13.07,40.68 v13.08,40.69
  Bottom 0.152: J3.4 11.46,41.84 11.46,40.54 11.92,40.09 12.42,40.09 13.03,40.69 v13.08,40.69
SWDIO  (via drill 0.35)
  Top 0.152: U$14.37 9.15,37.28 10.77,38.9 11.27,38.9 12.07,39.7 12.07,40.59 v12.17,40.69
  Bottom 0.152: J3.2 11.51,42.23 11.77,41.97 11.77,41.09 v12.17,40.69
SWITCH
  Top 0.152: U$14.39 11.35,36.88 15.46,40.99 18.1,40.99 20.18,43.07 20.18,46.57 22.1,48.5 34.17,48.5 34.47,48.2 34.47,46.6 36.27,44.8 38.37,44.8 42.17,48.6 50.07,48.6 53.37,45.3 59.47,45.3 61.46,47.29 DWN2.1
TS
  Top 0.152: R11.2 34.77,12.31 34.77,13.5 35.33,14.06 U1.10
TXD  (via drill 0.35)
  Top 0.152: v5.67,27.6 6.57,26.7 7.57,26.7 8.05,26.22 U$14.16 | U$17.3 29.72,39.85 v29.67,39.8
  Bottom 0.152: v29.67,39.8 25.6,39.8 25.1,39.3 16.97,39.3 16.47,38.8 7.4,38.8 6.39,37.78 6.39,32.34 6.78,31.95 6.78,31.45 6.42,31.09 6.26,31.09 6.07,30.9 6.07,28 v5.67,27.6
TXEN  (via drill 0.35)
  Top 0.152: 23.33,20.36 22.5,20.36 22.2,20.06 20.2,20.06 18.86,18.72 17.49,18.72 17.47,18.7 17.07,19.1 17.07,19.64 15.91,20.8 14.47,20.8 13.55,21.72 U$14.10
  Top 0.254: U$36.7 82.66,28.57 v83.82,28.57 | v80.01,21.59 U$15.TXEN v76.68,21.59 v76.67,21.6 | v23.37,20.4 23.33,20.36
  Bottom 0.254: v83.82,28.57 85.72,26.67 85.72,24.45 82.87,21.59 v80.01,21.59 | v76.67,21.6 74.58,19.51 64.1,19.51 56.9,12.31 41.84,12.31 34.04,20.11 23.66,20.11 v23.37,20.4
USB_N  (via drill 0.35)
  Top 0.152: v11.07,9.95 11.07,9.65 10.73,9.65 8.21,12.18 J2.B7 5.25,12.18 4.87,11.8 4.87,11.4 5.09,11.18 J2.A7 | v23.97,34.8 23.25,34.08 R15.1
  Bottom 0.152: v11.07,9.95 11.07,9.65 18.17,9.65 18.21,9.65 18.82,10.26 18.82,19.26 21.82,22.26 21.82,30.26 25.42,33.86 25.42,34.54 24.71,35.25 24.27,35.25 23.97,34.95 v23.97,34.8
USB_P  (via drill 0.35)
  Top 0.152: J2.A6 7.67,11.68 | 7.67,11.68 8.27,11.68 10.61,9.35 11.07,9.35 v11.07,9.05 | J2.B6 7.55,10.68 7.67,10.8 7.67,11.68 | v23.97,35.8 22.89,35.8 R14.1
  Bottom 0.152: v11.07,9.05 11.07,9.35 18.33,9.35 19.12,10.14 19.12,19.14 22.12,22.14 22.12,30.14 25.72,33.74 25.72,34.66 24.83,35.55 24.27,35.55 24.02,35.8 v23.97,35.8
VBAT
  Top 0.152: U1.7 35.21,15.26 34.87,15.6 33.78,15.6
  Top 0.406: R5.2 33.78,15.6
  Top 0.61: C1.1 30.45,10.02 30.47,10 28.57,8.1 24.07,8.1 19.27,12.9 17.37,12.9 16.88,12.4 Q3.3 | 30.12,12.53 C1.1 | R5.2 32.52,15.35 32.22,15.05 31.79,14.62 29.99,14.62 U$47.5 29.97,14.1 30.57,13.5 30.57,12.32 C1.1
VBUS  (via drill 0.35)  (1 unrouted)
  Top 0.152: 30.14,18.4 30.17,18.4 | C9.1 23.79,10.32 v25.17,8.94 | v23.17,7.2 23.47,6.9 23.67,6.9
  Top 0.254: R7.2 27.09,5.68 25.87,6.9 23.67,6.9 22.44,5.67 R3.2 | 23.98,14.62 24.67,13.93 v24.67,13.9 24.77,14 U$47.4 | 30.14,18.41 30.14,18.4
  Top 0.406: U$14.47 20.48,32.5 C10.2 21.21,32.24 21.97,33 24.17,33 25.97,31.2 v25.97,30.7 | v27.77,21.7 29.57,21.7 30.17,21.1 30.17,18.4 | 24.67,14.37 v24.67,13.9 | U$47.8 v31.46,18.41 v31.47,18.4
  Top 0.508: 12.97,13.23 D1.A | D1.A 13.97,13.28 Q3.1 | J2.VBUS2 7.55,8.98 7.61,9.04 9.97,9.04 10.74,8.26 11.39,8.26 11.97,8.84 11.97,13.3 | 11.97,13.3 13.2,13.3 D1.A | J2.VBUS1 10.71,13.88 R2.2 11.29,13.3 11.97,13.3
  Top 0.61: C9.1 23.79,14.42 23.98,14.62 17.11,14.62 Q3.1
  Bottom 0.152: v25.17,8.94 23.43,7.2 v23.17,7.2
  Bottom 0.406: v25.97,30.7 25.97,23.5 v27.77,21.7 | v31.47,18.4 31.07,18.8 25.47,18.8 24.67,18 v24.67,13.9
VHI  (via drill 0.35)
  Top 0.152: v15.27,8.7 v15.87,8.7 v16.47,8.7
  Top 0.254: SJ1.3 55.74,6.33 v55.67,6.4
  Top 0.508: C7.2 73.34,21.59 73.34,22.23 | C16.1 70.8,22.04 70.8,22.23 | U$35.P$1 64.14,23.5 | D1.C 14.65,9.58 14.88,9.8 Q3.2 | C13.1 13.4,8.02 U2.1 15.51,8.64 v15.27,8.7
  Top 0.813: D1.C 13.22,7.84 C13.1 | 64.77,24.7 U$35.P$1 61.9,24.13 59.37,21.6 R18.2 57.04,15.77 55.97,14.7 55.97,12.3 55.07,11.4 v55.07,7.6 v55.07,6.4 v55.67,6.4 v55.67,7.6 | v16.47,8.7 v16.47,8.1 v15.87,8.1 v15.27,8.1
  Top 2.54: U$35.P$1 68.9,24.13 70.8,22.23 73.34,22.23
  Bottom 0.152: v55.07,7.6 v55.07,7 v55.67,7
  Bottom 0.813: v15.27,8.7 18.57,8.7 22.37,4.9 33.07,4.9 33.97,5.8 55.07,5.8 v55.67,6.4

### Text on the board
tPlace: P0.10 | P0.09 | P1.04 | P1.02 | P1.01 | G | 3V | R | C | D | GND | TXD | RXD | VCC | VBAT | 5V | BLT | LORA-BLE-RELAY v2.1 | powered by Meshtastic | GND | SDA | 3V3 | SCL | P0.19 | 3V3 | P0.21 | GND | P0.26 | 5V | P0.06 | P0.08 | GND | 0x77 0x76 | - | + | FG | VHI
bPlace: -- | + | 1206 fuses | + | --